# EasyEDA Pro project ProPrj_PGEKI_MAIN_2025-10-30.epro

# Schematic MinigekiPCB

## Sheets
1 main
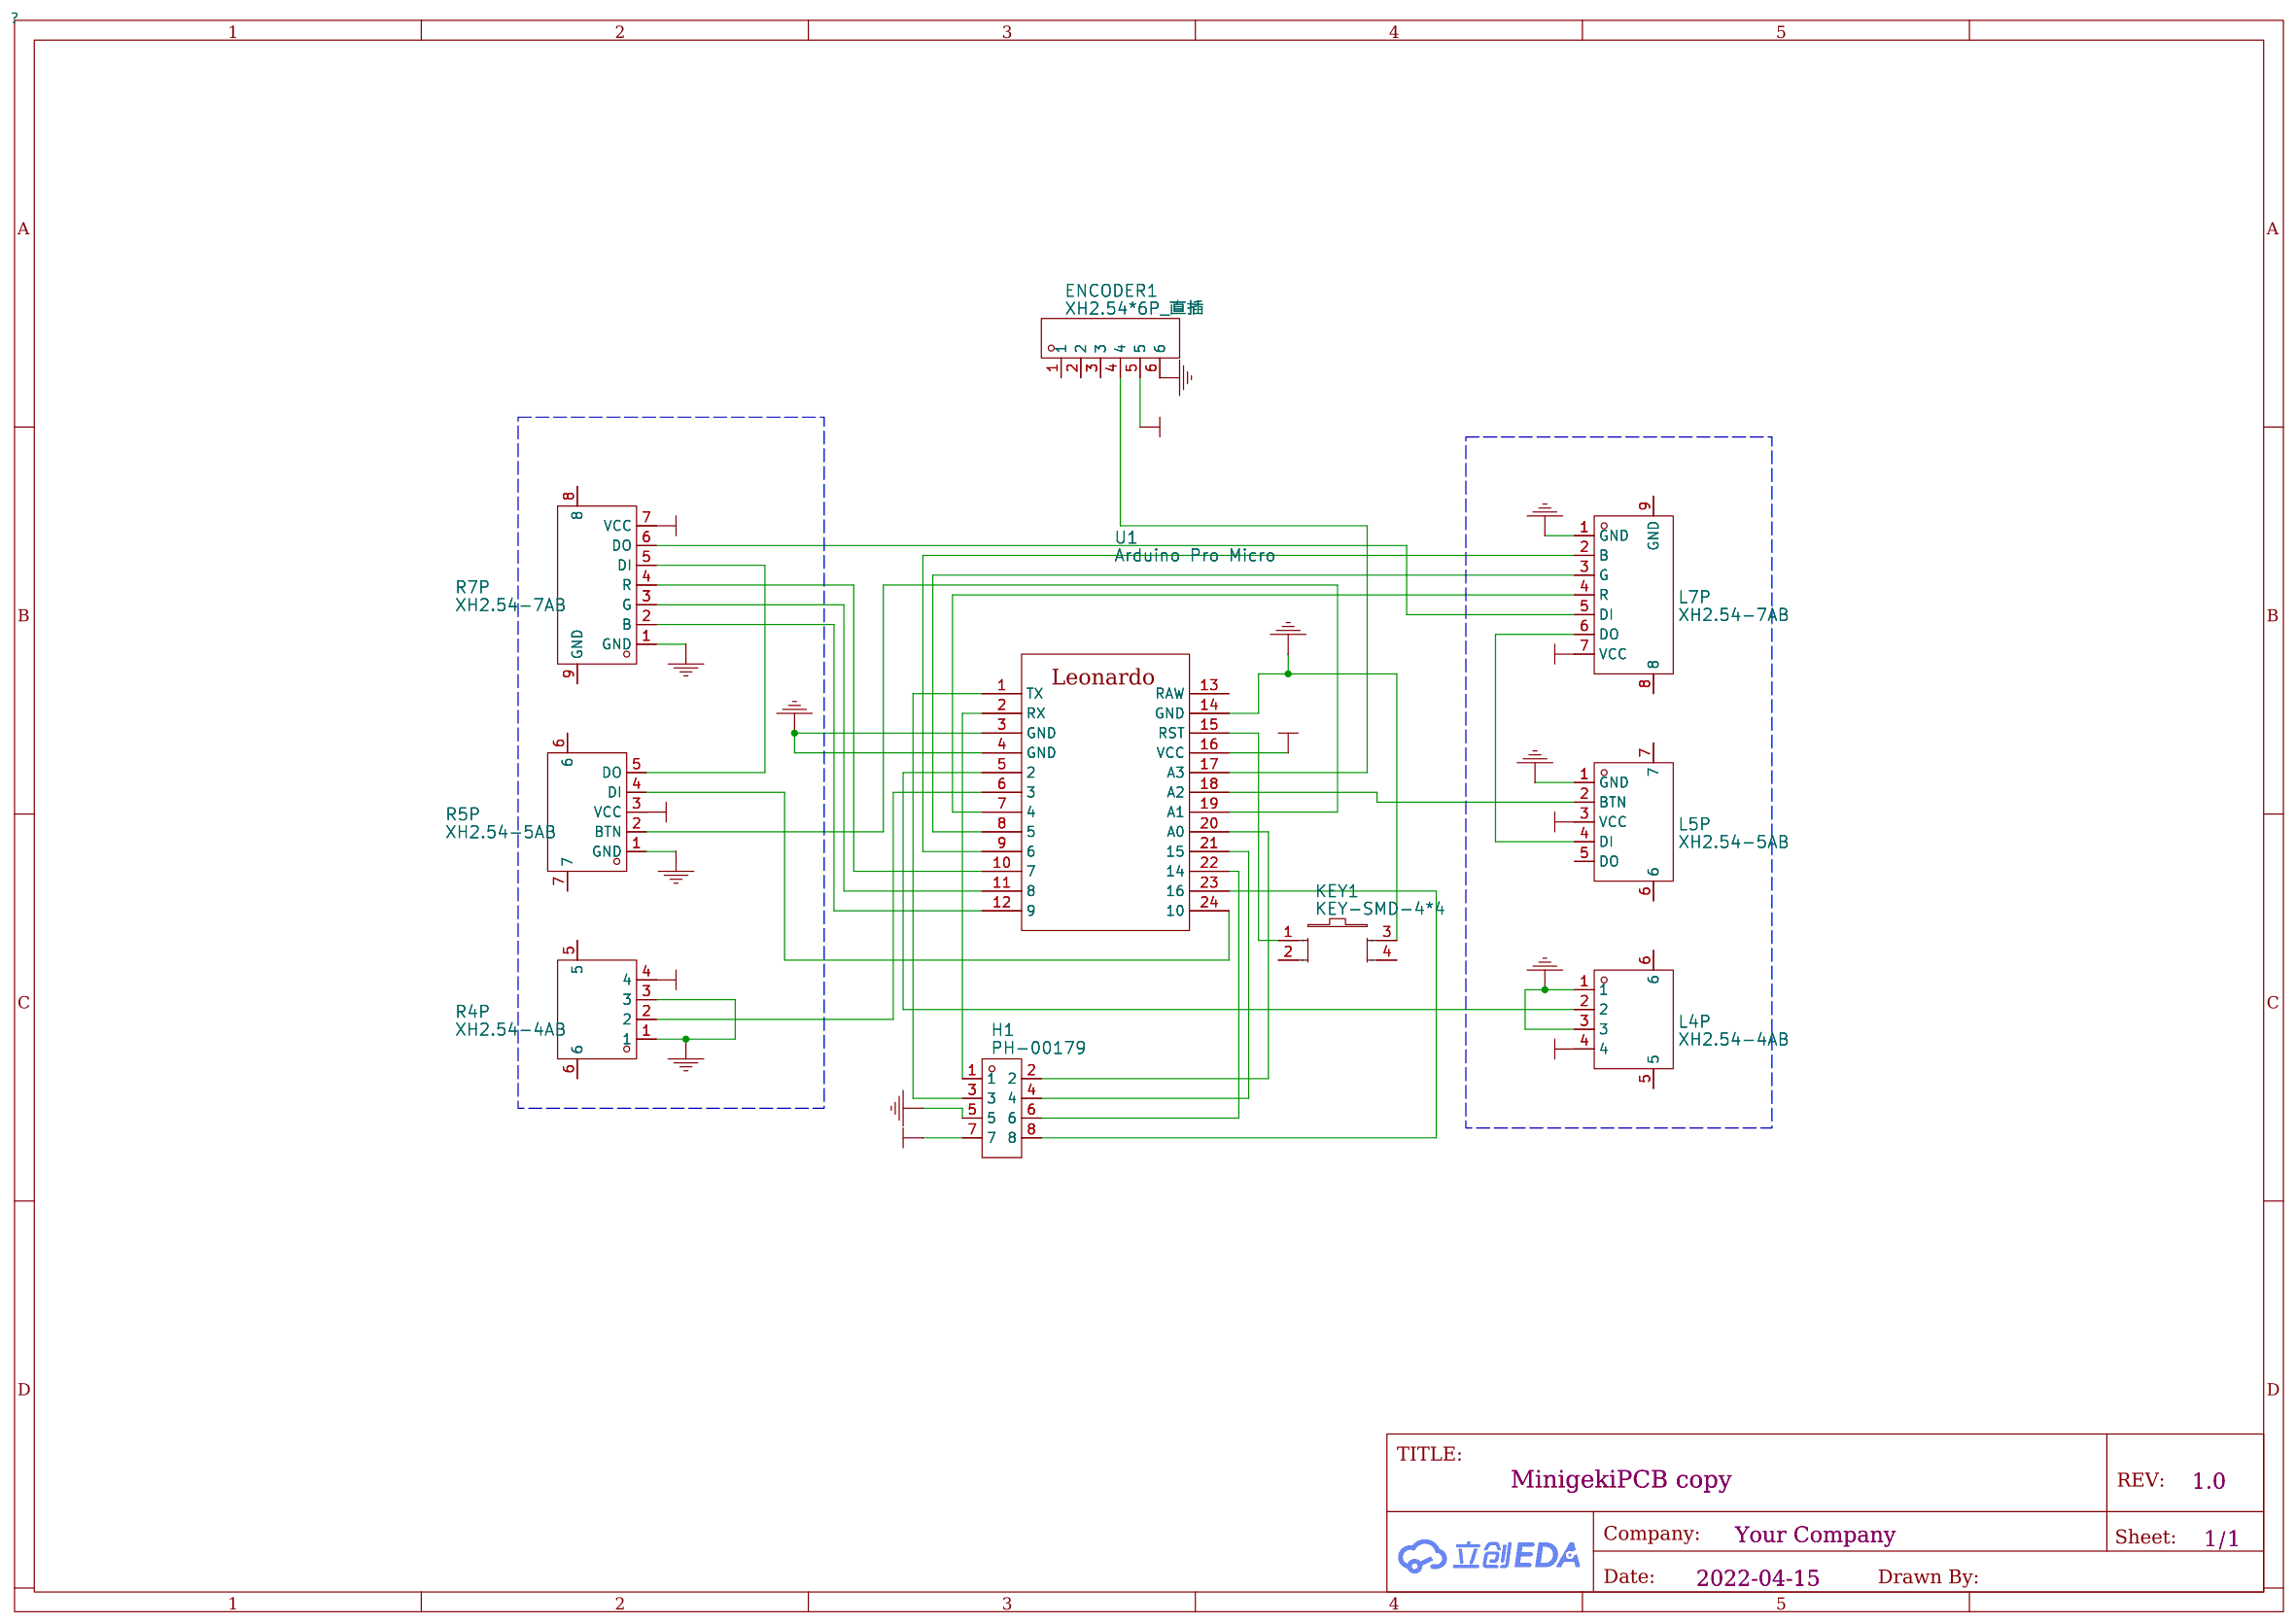
[diagram p0: main]
2 Sheet_2
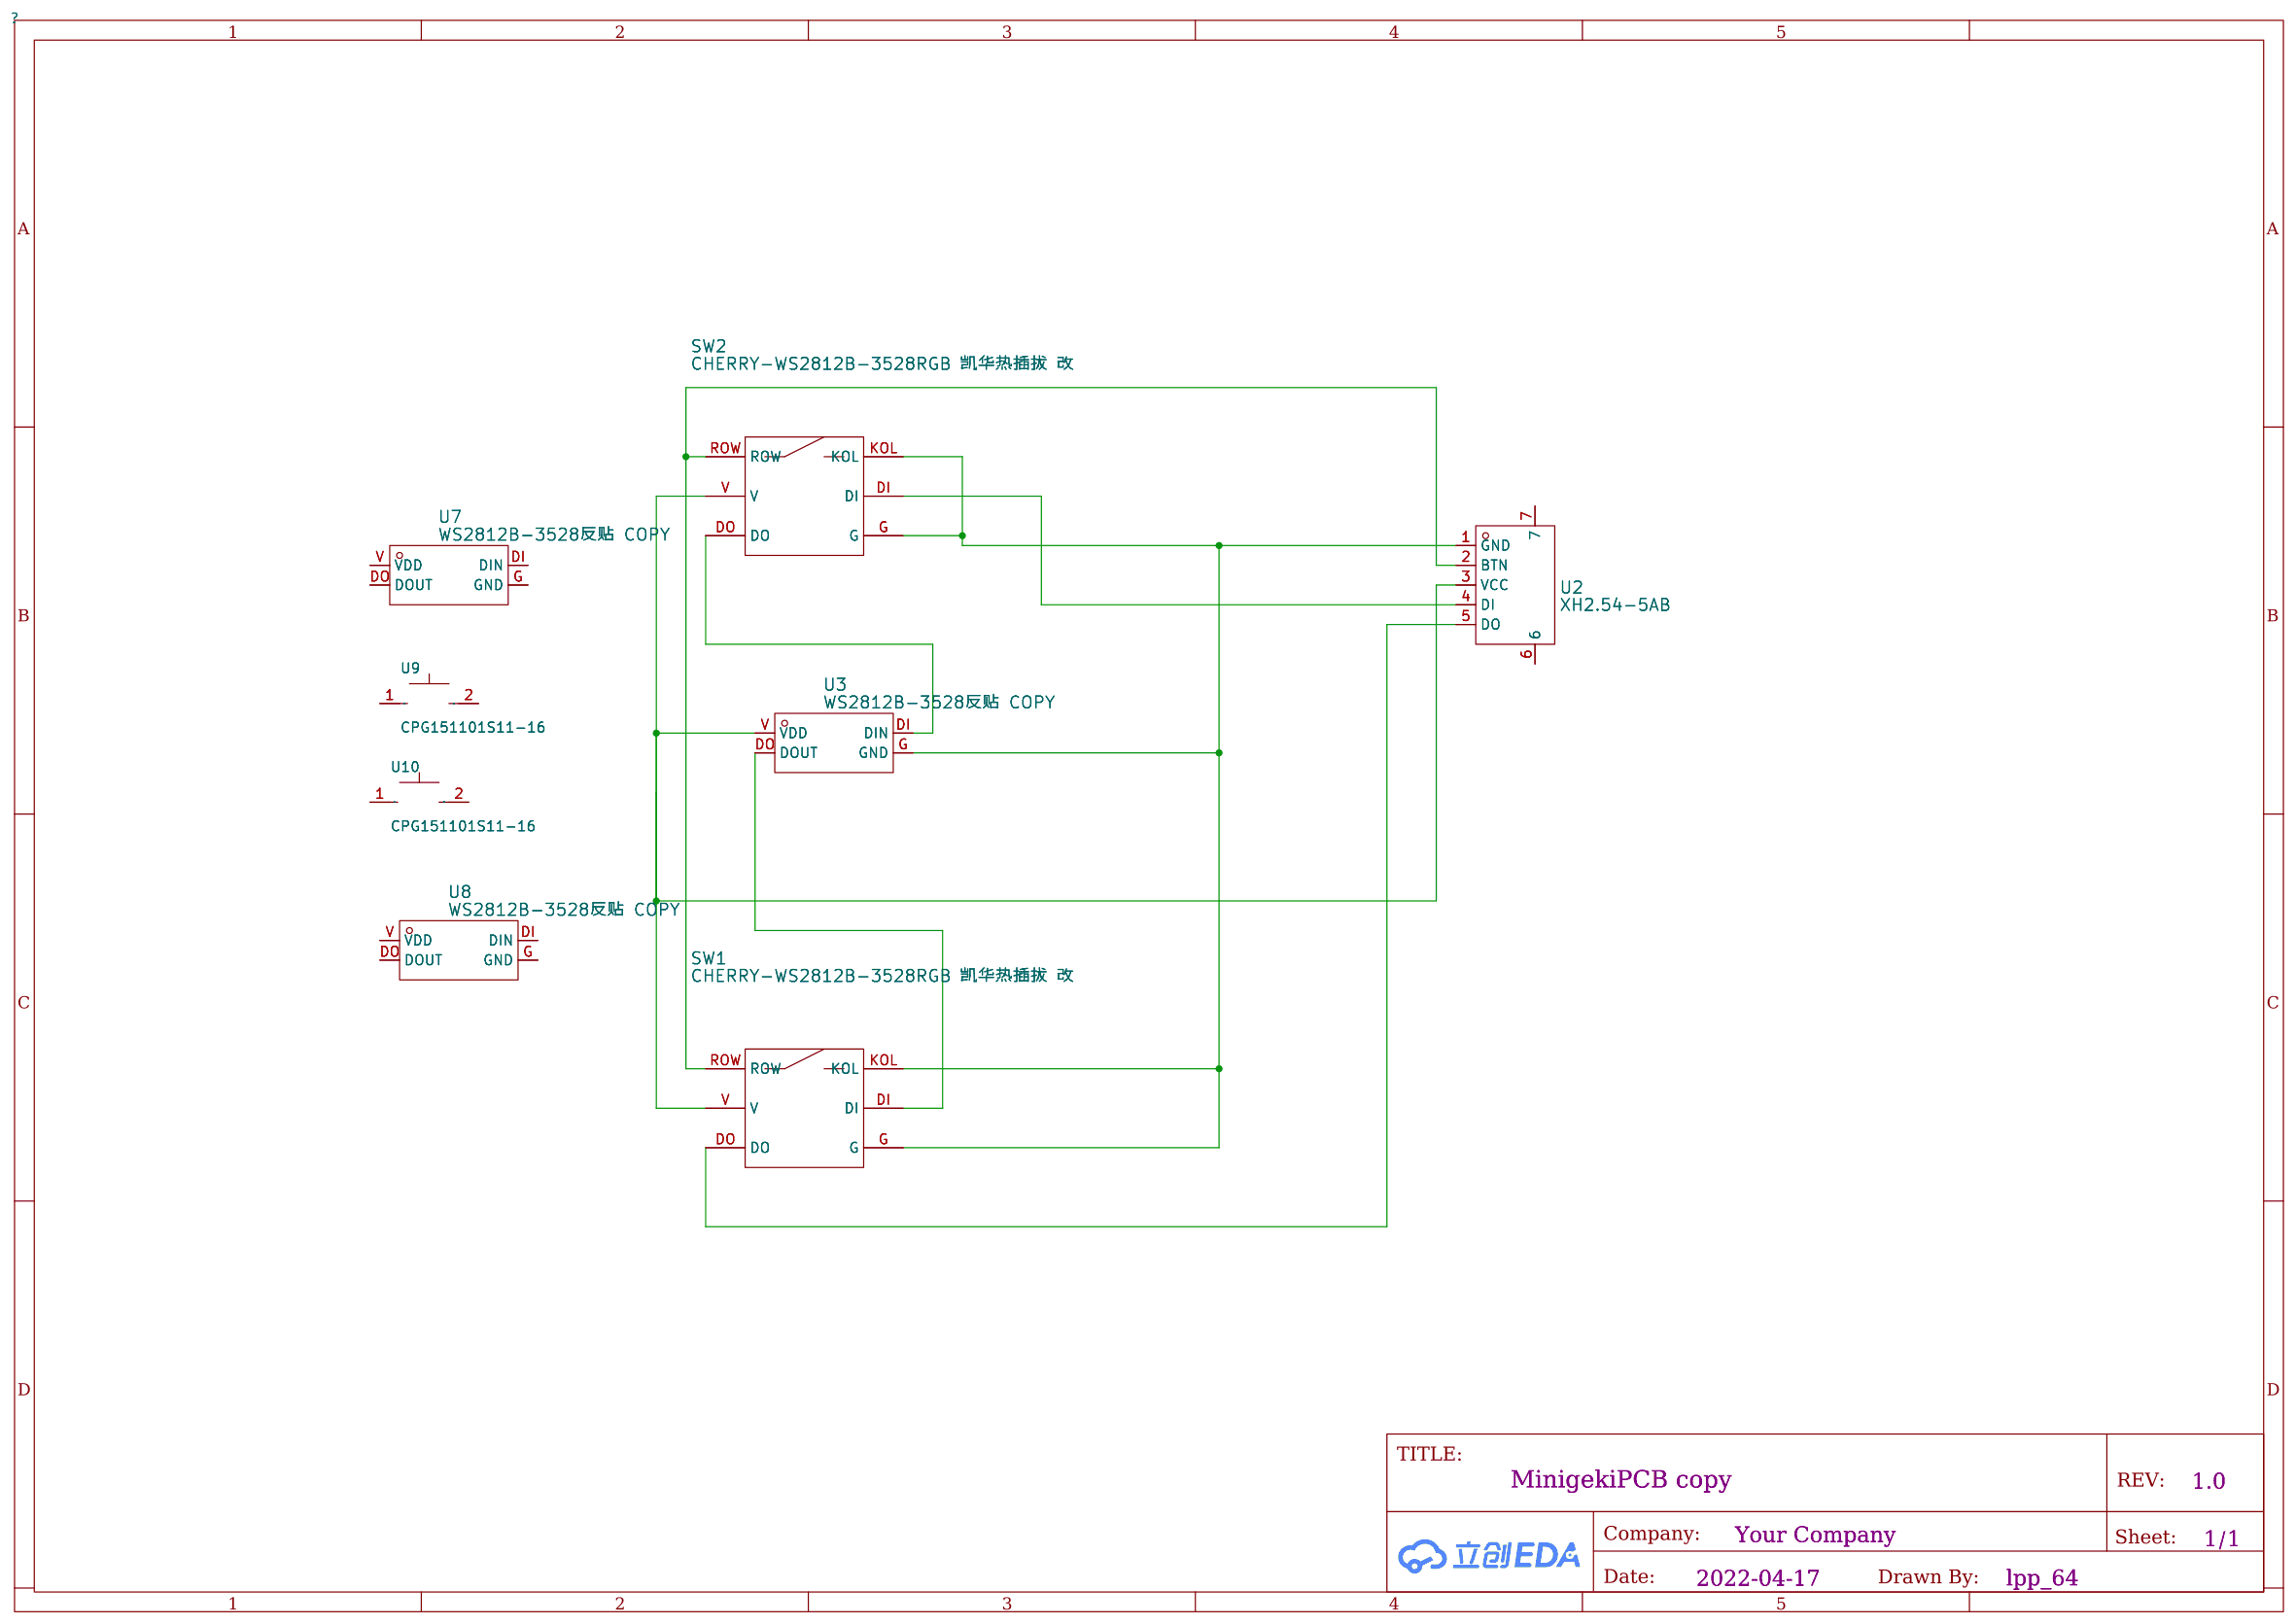
[diagram p1: Sheet_2]
3 Sheet_3
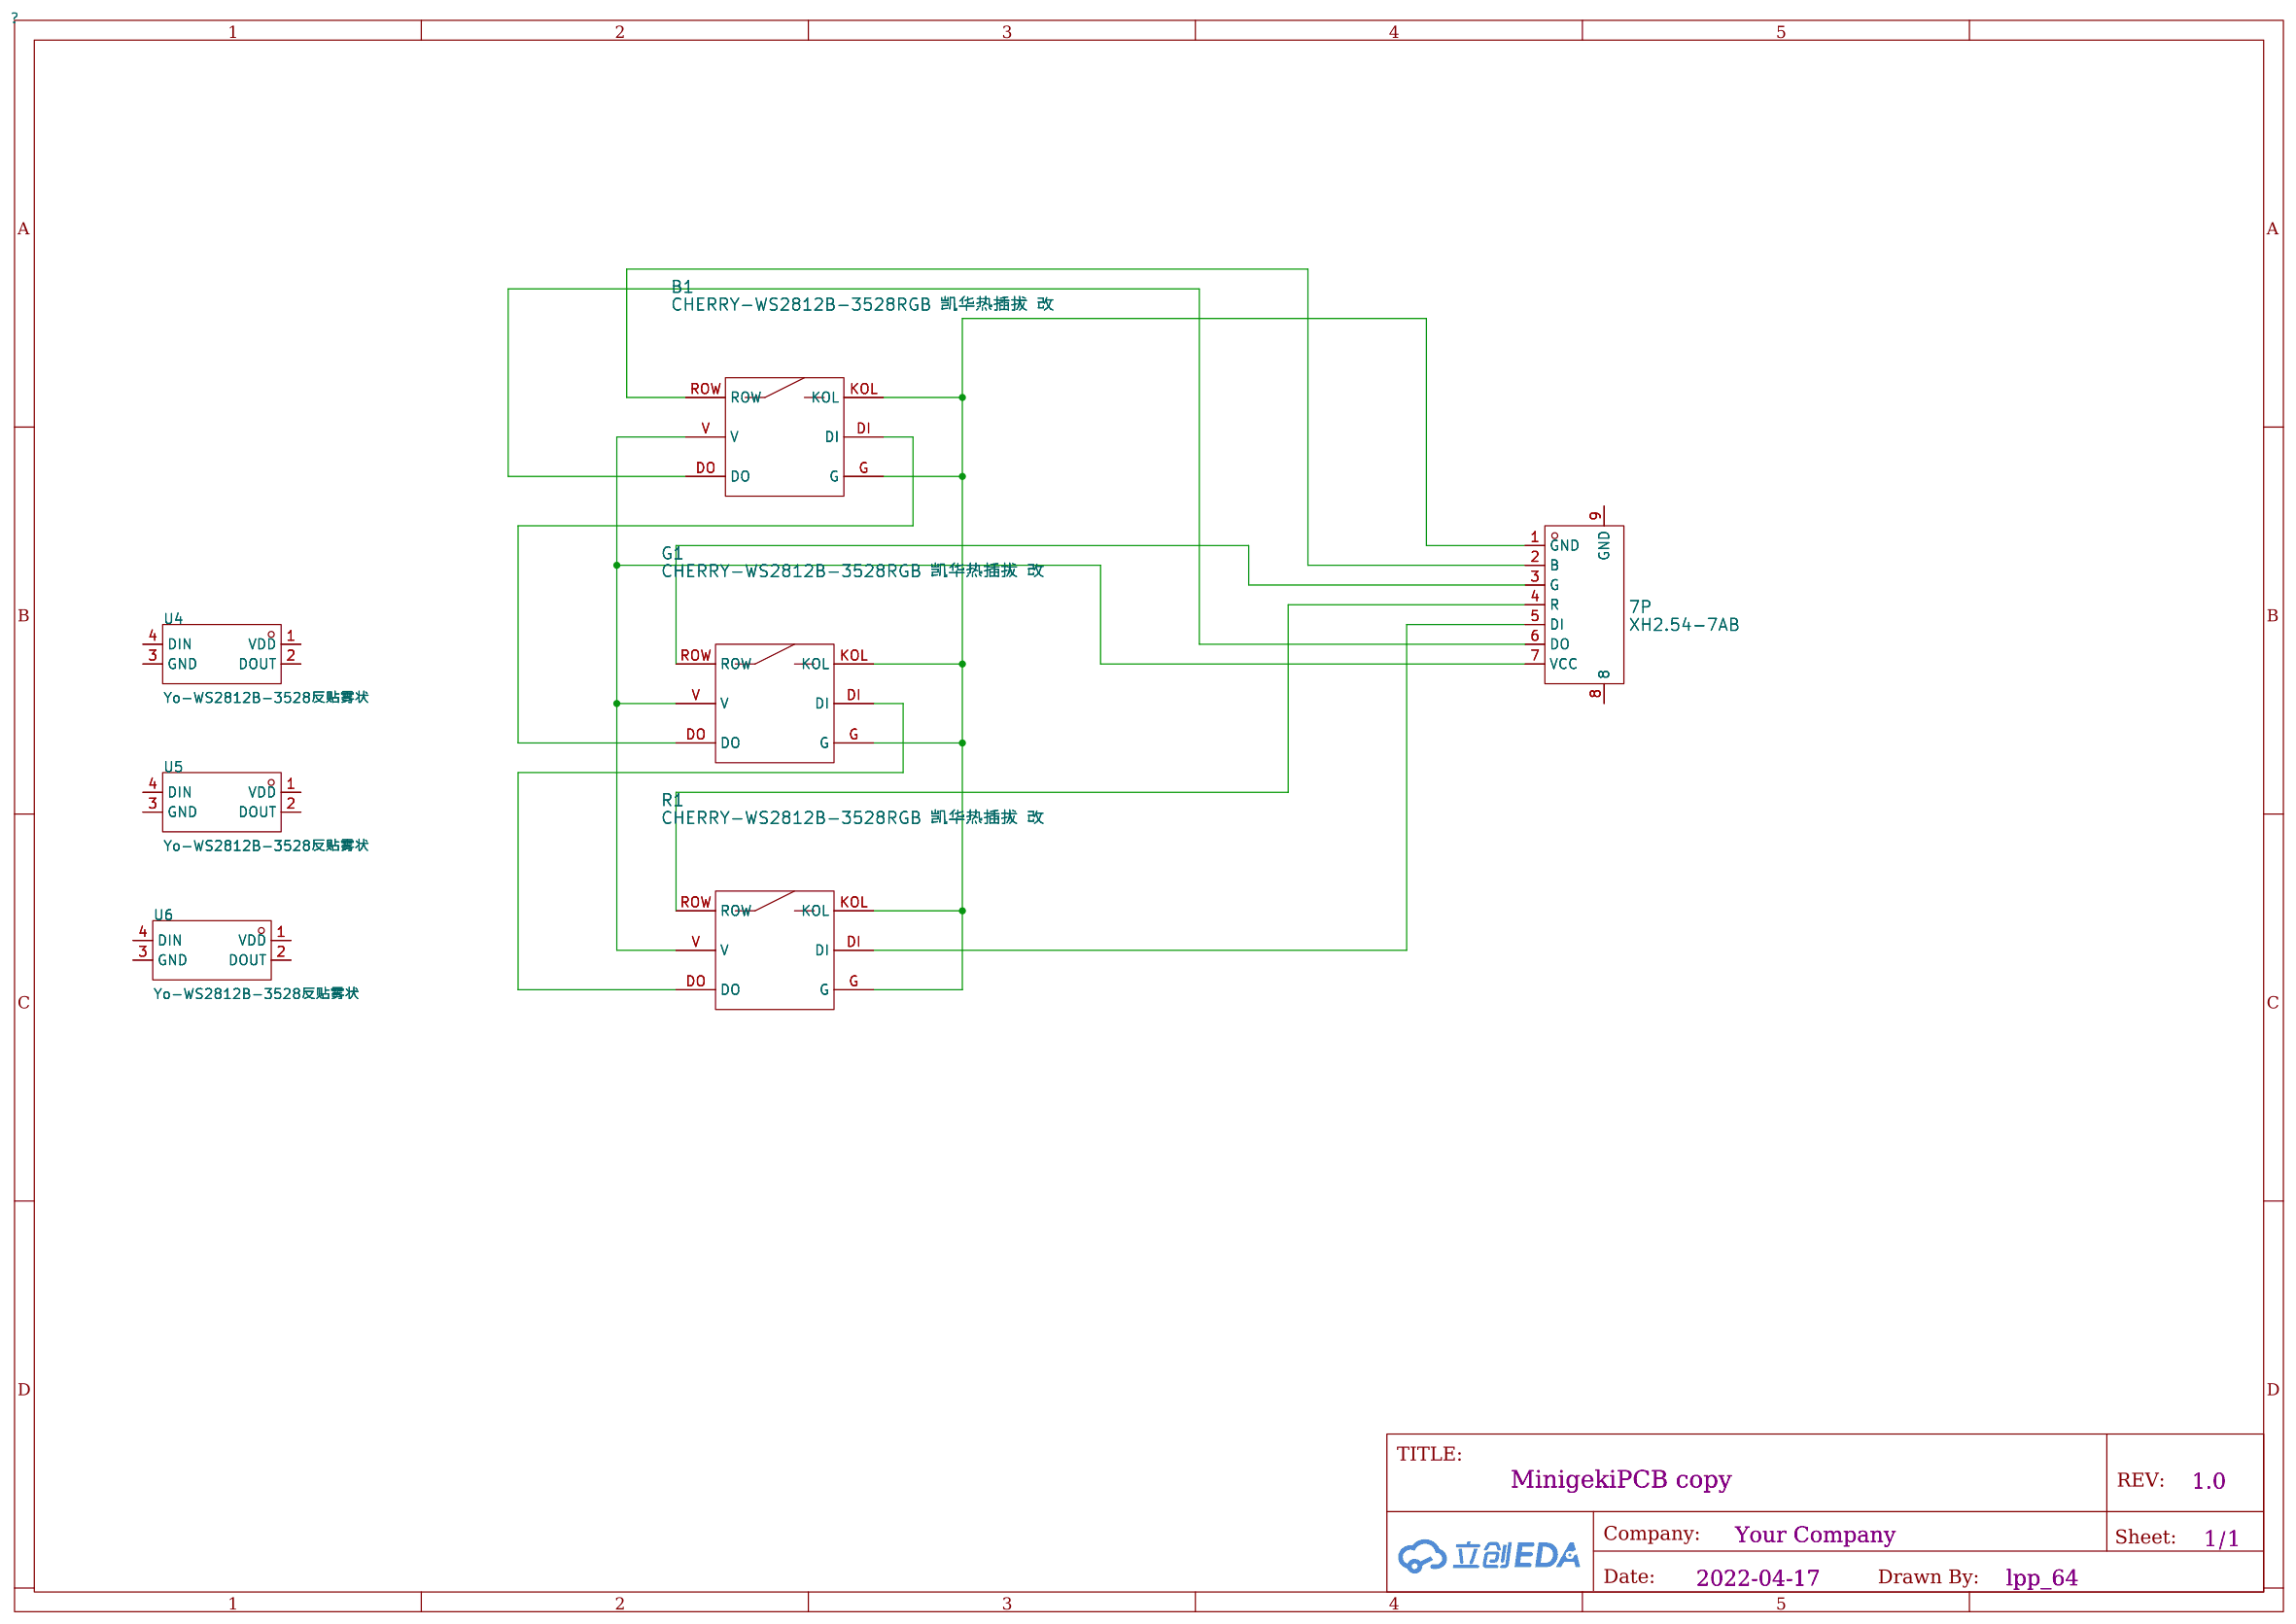
[diagram p2: Sheet_3]

## Parts
sheet main
ENCODER1  XH2.54*6P_直插  [CONN-TH_XH2.54-6P]
H1  PH-00179  [HDR-TH_8P-P2.54-V-M-R2-C4-S2.54]
KEY1  KEY-SMD-4*4  [SW-SMD_4P-L5.2-W5.2-P3.70-LS6.5]
L4P  XH2.54-4AB  [CONN-SMD_4P-P2.54_XH2.54-4AB]
L5P  XH2.54-5AB  [CONN-SMD_5P-P2.54_XH2.54-5AB]
L7P  XH2.54-7AB  [CONN-SMD_7P-P2.54_XH2.54-7AB]
R4P  XH2.54-4AB  [CONN-SMD_4P-P2.54_XH2.54-4AB]
R5P  XH2.54-5AB  [CONN-SMD_5P-P2.54_XH2.54-5AB]
R7P  XH2.54-7AB  [CONN-SMD_7P-P2.54_XH2.54-7AB]
U1  Arduino Pro Micro  [PROMICRO]
sheet Sheet_2
SW1  CHERRY-WS2812B-3528RGB 凯华热插拔 改  [凯华热插拔-WS2812-3528灯反贴-带二极管-KAILH-IN4148-3528]
SW2  CHERRY-WS2812B-3528RGB 凯华热插拔 改  [凯华热插拔-WS2812-3528灯反贴-带二极管-KAILH-IN4148-3528]
U2  XH2.54-5AB  [CONN-SMD_5P-P2.54_XH2.54-5AB]
U3  WS2812B-3528反贴 COPY  [WS2812-3528-反贴]
U7  WS2812B-3528反贴 COPY  [WS2812-3528-反贴]
U8  WS2812B-3528反贴 COPY  [WS2812-3528-反贴]
U9  CPG151101S11-16  [SMD_KEYBOARD-SW]
U10  CPG151101S11-16  [SMD_KEYBOARD-SW]
sheet Sheet_3
7P  XH2.54-7AB  [CONN-SMD_7P-P2.54_XH2.54-7AB]
B1  CHERRY-WS2812B-3528RGB 凯华热插拔 改  [凯华热插拔-WS2812-3528灯反贴-带二极管-KAILH-IN4148-3528]
G1  CHERRY-WS2812B-3528RGB 凯华热插拔 改  [凯华热插拔-WS2812-3528灯反贴-带二极管-KAILH-IN4148-3528]
R1  CHERRY-WS2812B-3528RGB 凯华热插拔 改  [凯华热插拔-WS2812-3528灯反贴-带二极管-KAILH-IN4148-3528]
U4  Yo-WS2812B-3528反贴雾状  [LED-SMD_L3.2-W2.8-BR_DY-S352818]
U5  Yo-WS2812B-3528反贴雾状  [LED-SMD_L3.2-W2.8-BR_DY-S352818]
U6  Yo-WS2812B-3528反贴雾状  [LED-SMD_L3.2-W2.8-BR_DY-S352818]

## Library data of the parts
ENCODER1 = XH2.54*6P_直插: Supplier: LCSC; Supplier Part: C9900008614; Manufacturer: null; JLCPCB Part Class: Extended Part
H1 = PH-00179: Supplier: LCSC; Supplier Part: C2829882; Manufacturer: Liansheng(连盛); JLCPCB Part Class: Extended Part
KEY1 = KEY-SMD-4*4: Supplier: LCSC; Supplier Part: C9900013835; Manufacturer: null; link: https://atta.szlcsc.comnull; JLCPCB Part Class: Extended Part
L4P R4P = -: Supplier: LCSC; Supplier Part: C146127; Manufacturer: Boom Precision Elec; JLCPCB Part Class: Extended Part
L5P R5P U2 = -: Supplier: LCSC; Supplier Part: C146128; Manufacturer: Boom Precision Elec; JLCPCB Part Class: Extended Part
L7P R7P = -: Supplier: LCSC; Supplier Part: C146130; Manufacturer: Boom Precision Elec; JLCPCB Part Class: Extended Part
U1 = Arduino Pro Micro
SW1 SW2 = CherryMX
U3 U7 U8 = Yo-WS2812B-3528反贴雾状: Supplier: LCSC; Supplier Part: C9900003682; Manufacturer: null; JLCPCB Part Class: Extended Part
U9 U10 = CPG151101S11-16: 轴类型:-;工作电压:2V~12V;操作力:-;触底力:-;触发行程:-;总行程:-;针脚数:-;机械寿命:-;工作温度:-;; Supplier Part: C5156480; Manufacturer: Kailh(凯华); JLCPCB Part Class: Extended Part; Datasheet: https://atta.szlcsc.com/upload/public/pdf/source/20220829/33DFC1A320A078D20879F2B21562B513.pdf; Supplier: LCSC; Operating Voltage: 2V~12V
7P = XH2.54-7AB: link: https://item.szlcsc.com/157457.html; 3DModel: CONN-SMD_XH2.50-LS-7P; Supplier: LCSC; Supplier Part: C146130; Manufacturer: Boom Precision Elec; JLCPCB Part Class: Extended Part
B1 G1 R1 = CHERRY-WS2812B-3528RGB 凯华热插拔 改 无二极管: Manufacturer Part: CherryMX
U4-U6 = Yo-WS2812B-3528反贴雾状: Supplier Part: C9900003682; Supplier Footprint: LED-SMD_L3.2-W2.8-BR_DY-S35281; JLCPCB Part Class: Extended Part; Datasheet: https://atta.szlcsc.comnull; Supplier: LCSC

## Nets
GND: ENCODER1.6 H1.5 KEY1.3 L4P.1 L4P.3 L5P.1(GND) L7P.1(GND) R4P.1 R4P.3 R5P.1(GND) R7P.1(GND) U1.3(GND) U1.4(GND) U1.14(GND)
VCC: ENCODER1.5 H1.7 L4P.4 L5P.3(VCC) L7P.7(VCC) R4P.4 R5P.3(VCC) R7P.7(VCC) U1.16(VCC)
$1N78: R5P.5(DO) R7P.5(DI)
$1N79: L7P.5(DI) R7P.6(DO)
$1N80: L5P.4(DI) L7P.6(DO)
$1N105: R4P.2 U1.6(3)
$1N106: L4P.2 U1.5(2)
$1N107: R5P.2(BTN) U1.19(A1)
$1N108: L5P.2(BTN) U1.18(A2)
$1N109: R7P.4(R) U1.10(7)
$1N110: R7P.3(G) U1.11(8)
$1N111: R7P.2(B) U1.12(9)
$1N112: L7P.4(R) U1.7(4)
$1N113: L7P.3(G) U1.8(5)
$1N114: L7P.2(B) U1.9(6)
$1N115: R5P.4(DI) U1.24(10)
$1N135: ENCODER1.4 U1.17(A3)
$1N232: H1.2 U1.20(A0)
$1N233: H1.4 U1.21(15)
$1N234: H1.6 U1.22(14)
$1N235: H1.8 U1.23(16)
$1N236: H1.3 U1.1(TX)
$1N237: H1.1 U1.2(RX)
Net-(7P-1): 7P.1(GND) B1.G B1.KOL G1.G G1.KOL R1.G R1.KOL
Net-(7P-2): 7P.2(B) B1.ROW
Net-(7P-3): 7P.3(G) G1.ROW
Net-(7P-4): 7P.4(R) R1.ROW
Net-(7P-5): 7P.5(DI) R1.DI
Net-(7P-6): 7P.6(DO) B1.DO
Net-(7P-7): 7P.7(VCC) B1.V G1.V R1.V
Net-(B1-DI): B1.DI G1.DO
Net-(G1-DI): G1.DI R1.DO
Net-(KEY1-1): KEY1.1 U1.15(RST)
Net-(SW1-DI): SW1.DI U3.DO(DOUT)
Net-(SW1-DO): SW1.DO U2.5(DO)
Net-(SW1-G): SW1.G SW1.KOL SW2.G SW2.KOL U2.1(GND) U3.G(GND)
Net-(SW1-ROW): SW1.ROW SW2.ROW U2.2(BTN)
Net-(SW1-V): SW1.V SW2.V U2.3(VCC) U3.V(VDD)
Net-(SW2-DI): SW2.DI U2.4(DI)
Net-(SW2-DO): SW2.DO U3.DI(DIN)

Not connected (* = marked no-connect by the designer): 7P 8 9(GND); ENCODER1 1 2 3; KEY1 2 4; L4P 5 6; L5P 5(DO) 6 7; L7P 8 9(GND); R4P 5 6; R5P 6 7; R7P 8 9(GND); U1 13(RAW); U2 6 7; U4 1(VDD) 2(DOUT) 3(GND) 4(DIN); U5 1(VDD) 2(DOUT) 3(GND) 4(DIN); U6 1(VDD) 2(DOUT) 3(GND) 4(DIN); U7 DI(DIN) DO(DOUT) G(GND) V(VDD); U8 DI(DIN) DO(DOUT) G(GND) V(VDD); U9 1 2; U10 1 2

# Board button_PCB1
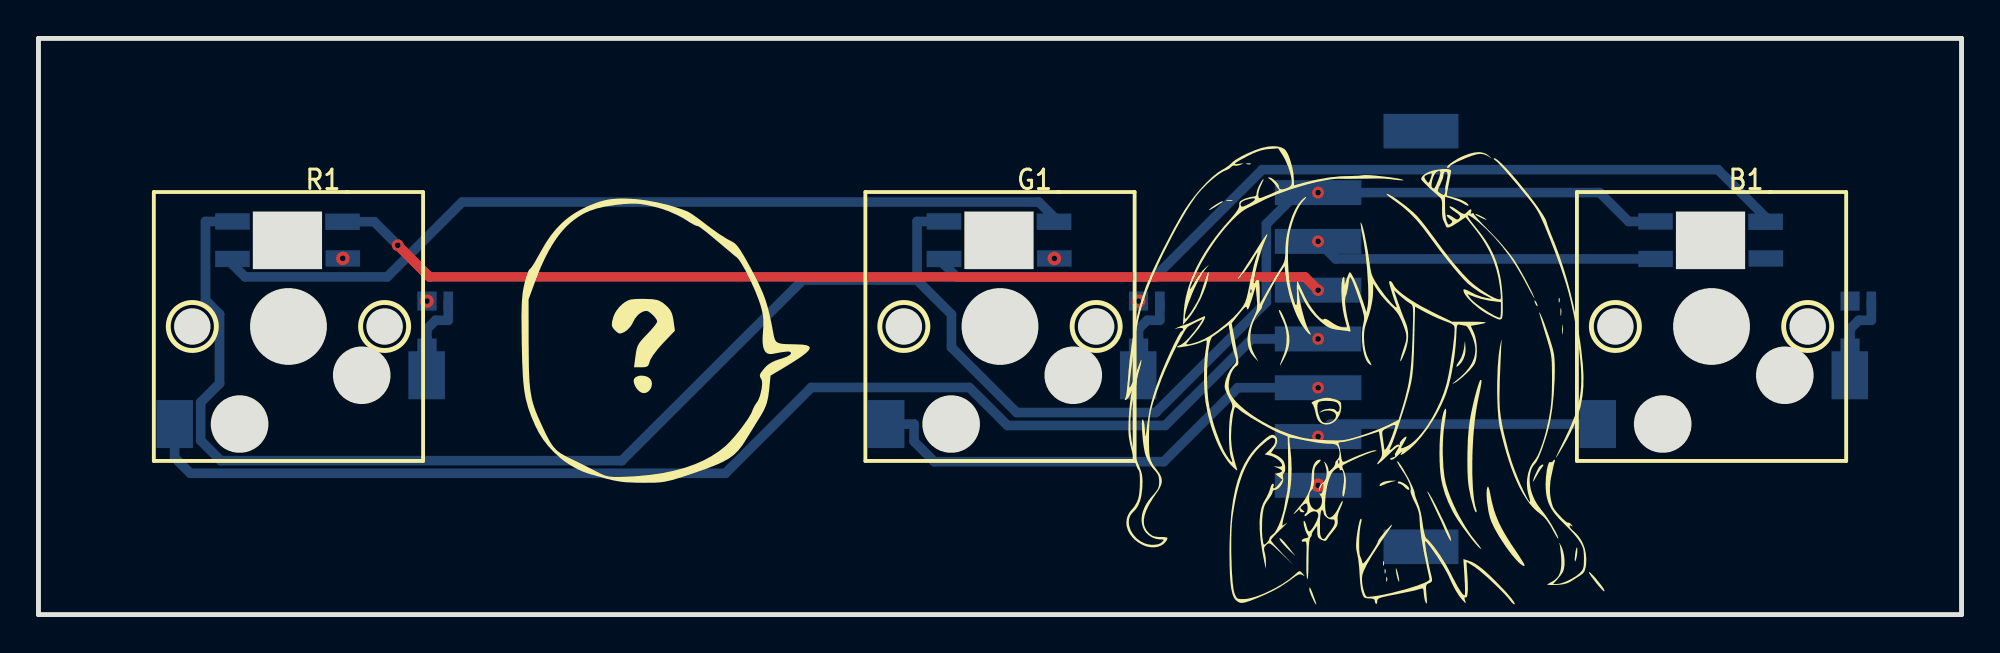
[diagram p3: board, top side]
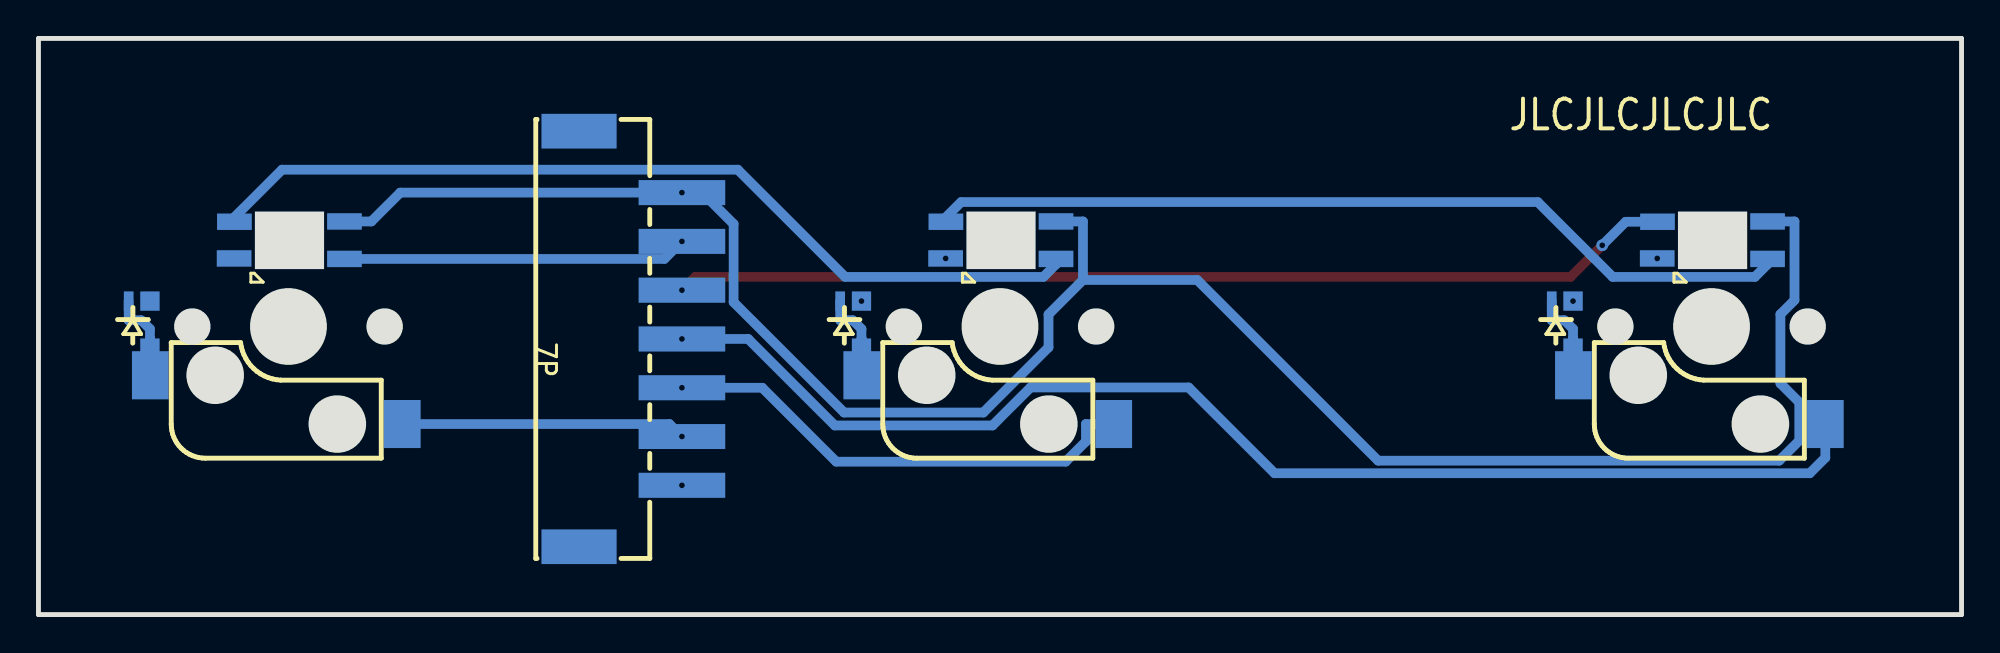
[diagram p4: board, bottom side, seen from below]

Outline 100 x 30 mm; copper layers: Top Layer, Bottom Layer. Coordinates in mm from the lower left corner of the outline.
Outline path: 0,30 100,30 100,0 0,0 0,30
Stack: Top Layer 0.035mm / Dielectric1 1.51mm FR4 er 4.5 / Bottom Layer 0.035mm

## Design rules (mm)
spacing Default (default): track to track 0.152, other pairs 0 to 0.152
track width Default (default): min 0.5, default 0.5, max 25.4
differential pair differentialPair (default): width min 0.127, default 0.254, max 2.54; gap min 0.152, default 0.152
via Default (default): diameter min 0.61, default 0.61, max 100.025; hole min 0.305, default 0.305, max 59.995
net R_G uses gge43096
pour e85 uses gge43096

## Placement (name value [footprint] x y rotation side)
7P  XH2.54-7AB  [CONN-SMD_7P-P2.54_XH2.54-7AB]  69.22 14.35 90 bottom
B1  CHERRY-WS2812B-3528RGB 凯华热插拔 改  [凯华热插拔-WS2812-3528灯反贴-带二极管-KAILH-IN4148-3528]  87 15 0 top
G1  CHERRY-WS2812B-3528RGB 凯华热插拔 改  [凯华热插拔-WS2812-3528灯反贴-带二极管-KAILH-IN4148-3528]  50 15 0 top
R1  CHERRY-WS2812B-3528RGB 凯华热插拔 改  [凯华热插拔-WS2812-3528灯反贴-带二极管-KAILH-IN4148-3528]  13 15 0 top

## Footprints (pads in the part's own frame, mm; a bottom-side part is the same pattern mirrored in y, then rotated)
CONN-SMD_7P-P2.54_XH2.54-7AB
  rect 1.3x4.5 smd: 1(-7.62,-2.675) 2(-5.08,-2.675) 3(-2.54,-2.675) 4(0,-2.675) 5(2.54,-2.675) 6(5.08,-2.675) 7(7.62,-2.675)
  rect 1.8x3.9 smd: 8(-10.82,2.675) 9(10.82,2.675)
凯华热插拔-WS2812-3528灯反贴-带二极管-KAILH-IN4148-3528
  rect 0.5x1 smd far side: 1(8.31,1.323)
  rect 1.8x0.85 smd far side: DI(2.811,5.453) DO(-2.912,3.517) G(2.826,3.543) V(-2.913,5.469)
  rect 1.9x2.5 smd far side: KOL(7.188,-2.54) ROW(-5.918,-5.08)
  rect 1x1 smd far side: R1(7.203,1.323) R2(7.203,-1.128)

## Nets
7P_2: 7P.2 B1.ROW
7P_3: 7P.3 G1.ROW
7P_6: 7P.6 B1.DO
7P_8: 7P.8
7P_9: 7P.9
B_DI: B1.DI G1.DO
B_KOL: B1.1 B1.KOL B1.R2
G_KOL: G1.1 G1.KOL G1.R2
R_DI: 7P.5 R1.DI
R_DO: G1.DI R1.DO
R_G: 7P.1 B1.G B1.R1 G1.G G1.R1 R1.G R1.R1
R_R2: R1.1 R1.KOL R1.R2
R_ROW: 7P.4 R1.ROW
R_V: 7P.7 B1.V G1.V R1.V

## Via types
v1: diameter 0.7, hole 0.305, Top Layer to Bottom Layer, 5 vias
v2: diameter 0.61, hole 0.305, Top Layer to Bottom Layer, 7 vias

## Routing (per net, layer and track width the routed paths; a pad name or vN(x,y) marks a point on that pad's centre or on a via; arc(x,y) is an arc through that point)
7P_2: length 14.8
  Bottom Layer w0.5: v2(66.54,9.27) 67.19,9.92 81.08,9.92
7P_3: length 25.4
  Bottom Layer w0.5: 44.08,9.92 45.53,9.92 45.53,9.01 46.58,7.96 58.52,7.96 62.37,11.81 v2(66.54,11.81)
7P_6: length 17.9
  Bottom Layer w0.5: v2(66.54,19.43) 67.45,18.52 B1.DO
B_DI: length 46.8
  Bottom Layer w0.5: B1.DI 89.81,20.69 87.33,23.17 63.64,23.17 58.05,17.58 47.74,17.58 47.09,18.24 G1.DO
B_KOL: length 5.2
  Bottom Layer w0.5: 94.19,12.46 94.19,14.36 94.2,14.37 ; 94.2,14.37 94.2,13.87 ; 94.2,14.37 94.2,14.87 94.65,15.32 95.31,15.32 B1.1
G_KOL: length 5.2
  Bottom Layer w0.5: 57.2,14.37 57.2,14.87 57.65,15.32 58.31,15.32 G1.1 ; 57.2,14.37 57.19,14.36 57.19,12.46 ; 57.2,14.37 57.2,13.87
R_DI: length 52.2
  Top Layer w0.5: v2(66.54,16.89) 65.85,17.58 20.33,17.58 v2(18.68,19.23)
  Bottom Layer w0.5: v2(18.68,19.23) 17.46,20.45 R1.DI
R_DO: length 45.4
  Bottom Layer w0.5: 52.81,20.45 52.81,20.69 52.02,21.48 22.03,21.48 18.14,17.58 10.74,17.58 10.09,18.24 R1.DO
R_G:
  vias: v1(15.83,18.54) v1(20.2,16.32) v1(52.83,18.54) v1(57.2,16.32) v1(66.54,6.73)
R_R2: length 5.2
  Bottom Layer w0.5: 20.2,13.87 20.2,14.37 ; 20.2,14.37 20.19,14.36 20.19,12.46 ; 20.2,14.37 20.2,14.87 20.65,15.32 21.31,15.32 R1.1
R_ROW: length 66.1
  Bottom Layer w0.5: 7.08,9.92 7.08,8.17 7.89,7.36 35.72,7.36 40.19,11.83 48.41,11.83 50.39,9.85 58.59,9.85 63.09,14.35 v2(66.54,14.35)
R_V: length 109.6
  Bottom Layer w0.5: 45.69,17.42 47.48,15.63 47.48,13.91 50.87,10.52 58.1,10.52 63.85,16.27 63.85,20.34 65.49,21.97 v2(66.54,21.97) 81.19,21.97 82.69,20.47 B1.V ; 45.69,17.42 39.74,17.42 30.34,8.02 9.48,8.02 8.44,9.06 8.44,11.05 9.42,12.03 9.42,15.64 8.69,16.37 8.69,20.47 R1.V ; 45.69,17.42 45.69,20.47 G1.V

## Copper pours and planes (outline as drawn; the poured copper is in the pictures)
R_G on Top Layer: -10.67,43.81 -10.67,-6.35 1.4,-18.41 112.52,-18.41 117.73,-13.21 117.73,43.31 117.47,43.56
R_G on Bottom Layer: -6.86,37.72 -6.86,-10.03 -7.11,-10.29 109.35,-10.29 111.25,-8.38 111.25,32.51 108.84,34.92

## Text on the board
Bottom Silkscreen Layer: JLCJLCJLCJLC

# Board PCB_MinigekiPCB
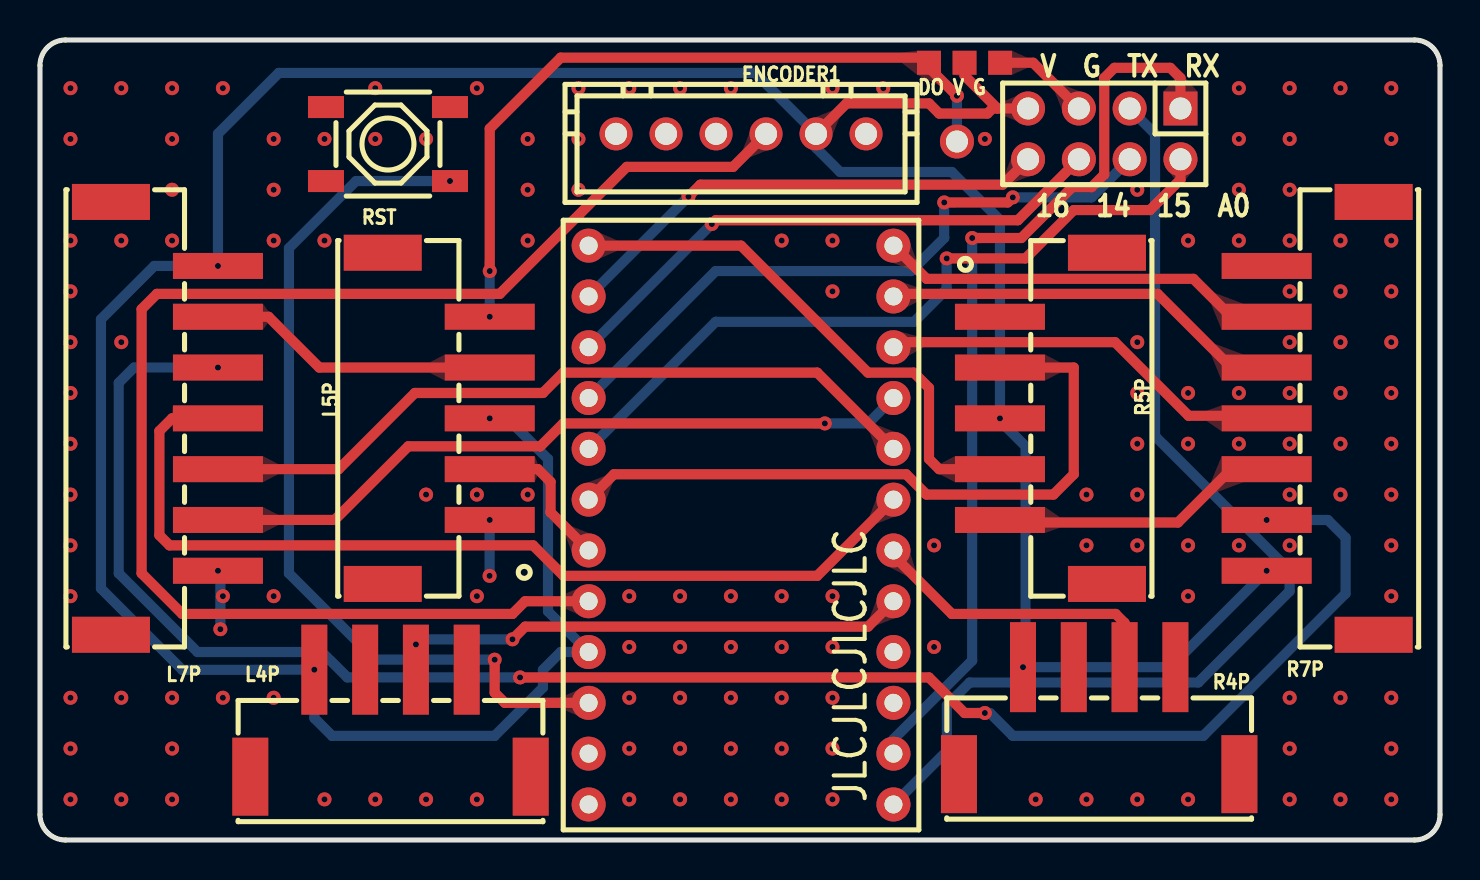
[diagram p5: board, top side]
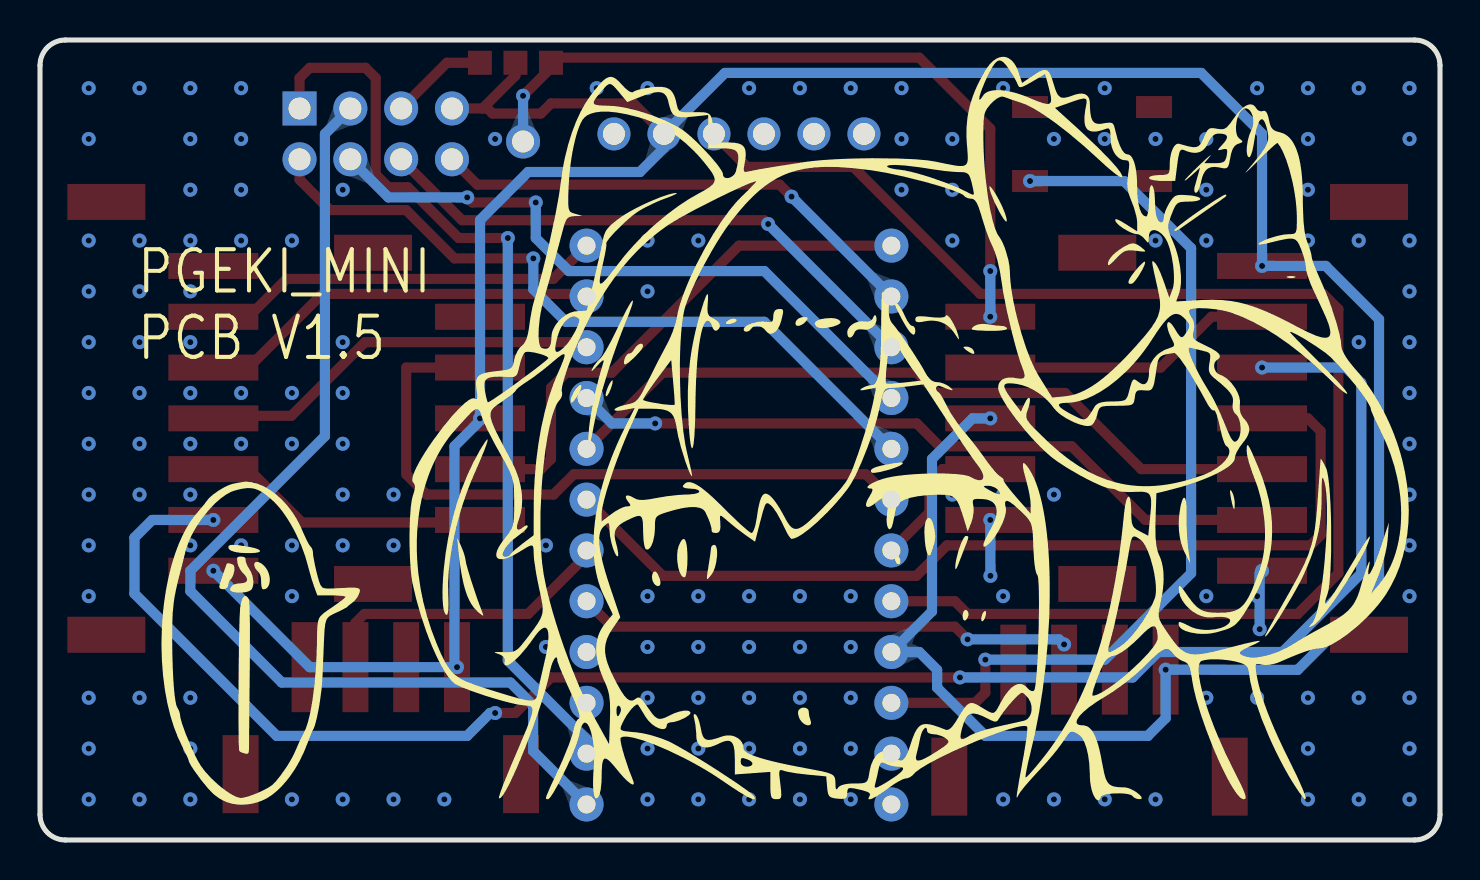
[diagram p6: board, bottom side, seen from below]

Outline 70 x 40 mm; copper layers: Top Layer, Bottom Layer. Coordinates in mm from the lower left corner of the outline.
Outline path: 0,38.73 arc(0.37,39.63) 1.27,40 68.73,40 arc(69.63,39.63) 70,38.73 70,1.27 arc(69.63,0.37) 68.73,0 1.27,0 arc(0.37,0.37) 0,1.27 0,38.73
Stack: Top Layer 0.035mm / Dielectric1 1.51mm FR4 er 4.5 / Bottom Layer 0.035mm

## Design rules (mm)
template: 用户自定义配置
spacing Default (default): track to track 0.152, other pairs 0 to 0.152
track width Default (default): min 0.254, default 0.254, max 25.4
differential pair differentialPair (default): width min 0.127, default 0.254, max 2.54; gap min 0.152, default 0.152
via Default (default): diameter min 0.7, default 0.7, max 100.025; hole min 0.305, default 0.305, max 59.995

## Placement (name value [footprint] x y rotation side)
ENCODER1  XH2.54*6P_直插  [CONN-TH_XH2.54-6P]  35.05 35.31 0 top
H1  PH-00179  [HDR-TH_8P-P2.54-V-M-R2-C4-S2.54]  53.21 35.31 180 top
L4P  XH2.54-4AB  [CONN-SMD_4P-P2.54_XH2.54-4AB]  17.53 5.84 180 top
L5P  XH2.54-5AB  [CONN-SMD_5P-P2.54_XH2.54-5AB]  19.81 21.08 90 top
L7P  XH2.54-7AB  [CONN-SMD_7P-P2.54_XH2.54-7AB]  6.22 21.08 90 top
NOREF  -  [Pad_e124]  48.01 38.86 0 top
NOREF#2  -  [Pad_e345]  45.85 34.92 180 top
NOREF#3  -  [Pad_e123]  46.23 38.86 0 top
NOREF#4  -  [Pad_e122]  44.45 38.86 0 top
R4P  XH2.54-4AB  [CONN-SMD_4P-P2.54_XH2.54-4AB]  52.96 5.97 180 top
R5P  XH2.54-5AB  [CONN-SMD_5P-P2.54_XH2.54-5AB]  50.67 21.08 270 top
R7P  XH2.54-7AB  [CONN-SMD_7P-P2.54_XH2.54-7AB]  64.01 21.08 270 top
RST  KEY-SMD-4*4  [SW-SMD_4P-L5.2-W5.2-P3.70-LS6.5]  17.4 34.8 180 top
U1  Arduino Pro Micro  [PROMICRO]  43.94 30.99 180 top

## Footprints (pads in the part's own frame, mm; a bottom-side part is the same pattern mirrored in y, then rotated)
CONN-SMD_4P-P2.54_XH2.54-4AB
  rect 1.3x4.5 smd: 1(-3.811,-2.675) 2(-1.271,-2.675) 3(1.269,-2.675) 4(3.809,-2.675)
  rect 1.8x3.9 smd: 5(-7.011,2.675) 6(7.011,2.675)
CONN-SMD_5P-P2.54_XH2.54-5AB
  rect 1.3x4.5 smd: 1(-5.08,-2.675) 2(-2.539,-2.675) 3(0.001,-2.675) 4(2.541,-2.675) 5(5.08,-2.675)
  rect 1.8x3.9 smd: 6(-8.28,2.675) 7(8.28,2.675)
CONN-SMD_7P-P2.54_XH2.54-7AB
  rect 1.3x4.5 smd: 1(-7.62,-2.675) 2(-5.08,-2.675) 3(-2.54,-2.675) 4(0,-2.675) 5(2.54,-2.675) 6(5.08,-2.675) 7(7.62,-2.675)
  rect 1.8x3.9 smd: 8(-10.82,2.675) 9(10.82,2.675)
CONN-TH_XH2.54-6P
  round 1.65 hole 1.1: 1(-6.25,0) 2(-3.75,0) 3(-1.25,0) 4(1.25,0) 5(3.75,0) 6(6.25,0)
HDR-TH_8P-P2.54-V-M-R2-C4-S2.54
  rect 1.7x1.7 hole 1.1: 1(-3.81,-1.27)
  round 1.7 hole 1.1: 2(-3.81,1.27) 3(-1.27,-1.27) 4(-1.27,1.27) 5(1.27,-1.27) 6(1.27,1.27) 7(3.81,-1.27) 8(3.81,1.27)
Pad_e122
  rect 1.2x1.2 smd: (0,0)
Pad_e123
  rect 1.2x1.2 smd: (0,0)
Pad_e124
  rect 1.2x1.2 smd: (0,0)
Pad_e345
  round 1.7 hole 1.1: 7(0,0)
PROMICRO
  round 1.7 hole 0.9: 1(1.27,29.21) 2(1.27,26.67) 3(1.27,24.13) 4(1.27,21.59) 5(1.27,19.05) 6(1.27,16.51) 7(1.27,13.97) 8(1.27,11.43) 9(1.27,8.89) 10(1.27,6.35) 11(1.27,3.81) 12(1.27,1.27) 13(16.51,29.21) 14(16.51,26.67) 15(16.51,24.13) 16(16.51,21.59) 17(16.51,19.05) 18(16.51,16.51) 19(16.51,13.97) 20(16.51,11.43) 21(16.51,8.89) 22(16.51,6.35) 23(16.51,3.81) 24(16.51,1.27)
SW-SMD_4P-L5.2-W5.2-P3.70-LS6.5
  rect 1.8x1.1 smd: 1(-3.1,1.85) 2(3.1,1.85) 3(-3.1,-1.85) 4(3.1,-1.85)

## Nets
As in the schematic, except:
GND: ENCODER1.6 H1.5 L4P.1 L4P.3 L5P.1 L7P.1 NOREF. R4P.1 R4P.3 R5P.1 R7P.1 RST.3 U1.3 U1.4 U1.14
VCC: ENCODER1.5 H1.7 L4P.4 L5P.3 L7P.7 NOREF#3. R4P.4 R5P.3 R7P.7 U1.16
$1N149: RST.1 U1.15

Pads without a net: ENCODER1 1 2 3; L4P 5 6; L5P 5 6 7; L7P 8 9; NOREF#2 7; R4P 5 6; R5P 6 7; R7P 8 9; RST 2 4; U1 13

## Via types
v1: diameter 0.7, hole 0.305, Top Layer to Bottom Layer, 28 vias
v2: diameter 0.701, hole 0.305, Top Layer to Bottom Layer, 148 vias

## Routing (per net, layer and track width the routed paths; a pad name or vN(x,y) marks a point on that pad's centre or on a via; arc(x,y) is an arc through that point)
GND: length 10.7
  Top Layer w0.508: 51.94,36.58 49.66,38.86 48.01,38.86
  Bottom Layer w0.508: v1(22.49,16) v1(22.48,13.21) ; v1(8.9,13.46) 9.02,13.34 v1(9.02,10.54)
  vias: v2(1.52,37.59) v2(1.52,35.05) v2(1.52,29.97) v2(1.52,27.43) v2(1.52,24.89) v2(1.52,22.35) v2(1.52,19.81) v2(1.52,17.27) v2(1.52,14.73) v2(1.52,12.19) v2(1.52,7.11) v2(1.52,4.57) v2(1.52,2.03) v2(4.06,37.59) v2(4.06,29.97) v2(4.06,24.89) v2(4.06,7.11) v2(4.06,2.03) v2(6.6,37.59) v2(6.6,35.05) v2(6.6,32.51) v2(6.6,29.97) v2(6.6,7.11) v2(6.6,4.57) v2(6.6,2.03) v2(9.14,37.59) v2(9.14,12.19) v2(9.14,7.11) v2(11.68,35.05) v2(11.68,32.51) v2(11.68,29.97) v2(11.68,12.19) v2(11.68,7.11) v2(14.22,35.05) v2(14.22,29.97) v2(14.22,2.03) v2(16.76,37.59) v2(16.76,35.05) v2(16.76,2.03) v2(19.3,35.05) v2(19.3,17.27) v2(19.3,2.03) v2(21.84,37.59) v2(21.84,17.27) v2(21.84,12.19) v2(21.84,2.03) v2(24.38,35.05) v2(24.38,32.51) v2(24.38,29.97) v2(24.38,17.27) v2(26.92,37.59) v2(26.92,35.05) v2(26.92,32.51) v2(29.46,37.59) v2(29.46,12.19) v2(29.46,9.65) v2(29.46,7.11) v2(29.46,4.57) v2(29.46,2.03) v2(32,37.59) v2(32,12.19) v2(32,9.65) v2(32,7.11) v2(32,4.57) v2(32,2.03) v2(34.54,37.59) v2(34.54,12.19) v2(34.54,9.65) v2(34.54,7.11) v2(34.54,4.57) v2(34.54,2.03) v2(37.08,29.97) v2(37.08,12.19) v2(37.08,9.65) v2(37.08,7.11) v2(37.08,4.57) v2(37.08,2.03) v2(39.62,37.59) v2(39.62,29.97) v2(39.62,27.43) v2(39.62,12.19) v2(39.62,9.65) v2(39.62,7.11) v2(39.62,4.57) v2(39.62,2.03) v2(42.16,37.59) v2(44.7,14.73) v2(44.7,9.65) v2(47.24,35.05) v2(49.78,2.03) v2(52.32,17.27) v2(52.32,14.73) v2(52.32,2.03) v2(54.86,32.51) v2(54.86,24.89) v2(54.86,22.35) v2(54.86,19.81) v2(54.86,17.27) v2(54.86,14.73) v2(54.86,2.03) v2(57.4,29.97) v2(57.4,22.35) v2(57.4,19.81) v2(57.4,14.73) v2(57.4,12.19) v2(57.4,2.03) v2(59.94,37.59) v2(59.94,35.05) v2(59.94,32.51) v2(59.94,29.97) v2(59.94,22.35) v2(59.94,19.81) v2(59.94,14.73) v2(62.48,37.59) v2(62.48,35.05) v2(62.48,32.51) v2(62.48,29.97) v2(62.48,27.43) v2(62.48,24.89) v2(62.48,22.35) v2(62.48,19.81) v2(62.48,17.27) v2(62.48,14.73) v2(62.48,7.11) v2(62.48,4.57) v2(62.48,2.03) v2(65.02,37.59) v2(65.02,29.97) v2(65.02,27.43) v2(65.02,24.89) v2(65.02,22.35) v2(65.02,19.81) v2(65.02,17.27) v2(65.02,7.11) v2(65.02,2.03) v2(67.56,37.59) v2(67.56,35.05) v2(67.56,29.97) v2(67.56,27.43) v2(67.56,24.89) v2(67.56,22.35) v2(67.56,19.81) v2(67.56,17.27) v2(67.56,14.73) v2(67.56,12.19) v2(67.56,7.11) v2(67.56,4.57) v2(67.56,2.03)
VCC: length 167.8
  Top Layer w0.508: 46.23,38.86 46.23,38.22 47.87,36.58 ; ENCODER1.5 40.33,36.83 44.45,36.83 44.96,36.32 47.37,36.32 47.62,36.58 47.87,36.58 ; 47.87,36.58 H1.7
  Bottom Layer w0.508: v1(22.49,21.08) 23.37,21.08 25.4,19.05 25.4,11.43 U1.16 26.03,9.4 25.15,8.51 25.15,7.62 22.73,5.21 14.61,5.21 13.72,6.09 v1(13.72,8.52) 7.11,8.51 3.05,12.57 3.05,26.03 5.72,28.7 8.9,28.7 8.9,35.31 11.94,38.35 35.75,38.35 38.8,35.31 ; v1(61.33,13.46) 56.51,8.64 v1(49.15,8.64) 49.28,8.77 49.28,19.69 48,20.96 48,31 45.59,33.4 40,33.4 38.8,34.6 38.8,35.31
  vias: v1(8.9,28.7) v1(48,21.08)
(no net): length 37.5
  Top Layer w0.508: v1(45.85,37.21) 44.45,38.61 44.45,38.86 44.2,39.12 26.03,39.12 22.49,35.57 v1(22.49,28.45)
  Bottom Layer w0.508: v1(22.49,26.16) v1(22.49,28.45) ; v1(45.85,37.21) NOREF#2.7
$1N78: length 14.5
  Top Layer w0.508: R5P.5 48.12,15.88 56.9,15.88 59.57,18.54 R7P.5
$1N79: length 89.6
  Top Layer w0.508: v1(24,8.13) 44.45,8.13 46.23,6.35 v1(47.24,6.35)
  Bottom Layer w0.508: v1(8.9,23.62) 4.7,23.62 3.94,22.86 3.94,13.33 7.87,9.4 14.1,9.4 15.37,8.13 v1(24,8.13) ; v1(47.24,6.35) 47.5,6.35 48.64,5.21 58.17,5.21 65.28,12.32 65.28,15.11 64.39,16 v1(61.33,16)
$1N80: length 14.6
  Top Layer w0.508: L5P.4 13.97,23.62 11.43,26.16 L7P.6
$1N105: length 15.4
  Top Layer w0.508: U1.6 42.67,14.22 45.59,11.3 53.78,11.3 54.23,10.85 R4P.2
$1N106: length 24.8
  Top Layer w0.508: U1.5 41.4,10.67 24.26,10.67 v1(23.62,10.03)
  Bottom Layer w0.508: v1(23.62,10.03) 19.05,10.03 v1(18.8,9.78)
$1N107: length 34.6
  Top Layer w0.508: U1.19 28.7,18.29 43.31,18.29 44.32,17.27 50.67,17.27 51.69,18.29 51.69,23.62 R5P.2
$1N108: length 7.5
  Top Layer w0.508: 22.49,18.54 24.89,18.54 25.53,17.91 25.53,16.38 U1.18
$1N109: length 20.3
  Top Layer w0.508: R7P.4 61.21,21.21 57.43,21.21 53.75,24.89 42.93,24.89 U1.10
$1N110: length 20.2
  Top Layer w0.508: R7P.3 59.57,23.62 55.88,27.31 42.8,27.31 U1.11
$1N111: length 20.1
  Top Layer w0.508: U1.12 44.33,28.06 57.67,28.06 59.57,26.16 R7P.2
$1N112: length 47.5
  Top Layer w0.508: L7P.4 6.6,21.08 5.97,20.45 5.97,15.24 6.48,14.73 24.65,14.73 26.18,13.21 38.86,13.21 U1.7
$1N113: length 37.4
  Top Layer w0.508: L7P.3 14.94,18.54 18.75,22.35 25.15,22.35 26.16,23.37 38.86,23.37 U1.8
$1N114: length 36.3
  Top Layer w0.508: v1(39.24,20.83) 26.16,20.83 25.02,19.69 18.41,19.69 14.73,16 L7P.2
  Bottom Layer w0.508: U1.9 41.4,20.83 v1(39.24,20.83)
$1N115: length 27.3
  Top Layer w0.508: U1.24 35.05,29.72 41.4,23.37 43.69,23.37 44.45,22.61 44.45,19.05 44.96,18.54 R5P.4
$1N135: length 71.5
  Top Layer w0.508: ENCODER1.4 34.65,33.66 29.34,33.66 22.99,27.31 5.84,27.31 5.08,26.54 5.08,13.33 7.11,11.3 23.62,11.3 24.26,11.94 U1.17
$1N149: length 44.3
  Top Layer w0.508: U1.15 23.24,6.86 22.73,7.37 v1(22.73,9.02)
  Bottom Layer w0.508: v1(22.73,9.02) 16.76,9.02 12.45,13.33 12.45,29.59 15.8,32.95 v1(20.5,32.95)
$1N232: length 37.1
  Top Layer w0.508: v1(45.34,29.08) 49.27,29.08 51.69,31.5 55.5,31.5 57.02,33.02 H1.2
  Bottom Layer w0.508: v1(45.34,29.08) 45.34,27.54 43.7,25.91 33.78,25.91 U1.20
$1N233: length 33
  Top Layer w0.508: v1(45.21,31.88) 48.39,31.88 v1(48.64,32.13)
  Bottom Layer w0.508: H1.4 52.58,32.13 v1(48.64,32.13) ; v1(45.21,31.88) 45.21,30.1 43.56,28.45 33.78,28.45 27.43,22.1
$1N234: length 28.4
  Top Layer w0.508: v1(33.59,30.8) 33.78,30.99 48.9,30.99 51.94,34.04
  Bottom Layer w0.508: U1.22 v1(33.59,30.8)
$1N235: length 24.8
  Top Layer w0.508: v1(32.42,32.17) 33.02,32.77 48.13,32.77 H1.8
  Bottom Layer w0.508: U1.23 v1(32.42,32.17)
$1N236: length 53
  Bottom Layer w0.508: U1.1 45.34,4.45 45.34,6.74 46.48,7.87 57.91,7.87 62.48,12.45 62.48,13.46 55.75,20.19 55.75,35.31 H1.3
$1N237: length 45.9
  Top Layer w0.508: v1(46.61,30.1) 49.07,30.1 51.61,32.64 52.58,32.64 53.21,33.27 53.21,38.1 53.72,38.61 56.51,38.61 57.02,38.1 H1.1
  Bottom Layer w0.508: v1(46.61,30.1) 46.61,8.97 42.67,5.04 U1.2

## Copper pours and planes (outline as drawn; the poured copper is in the pictures)
GND on Top Layer: -6.1,51.31 -6.1,2.79 4.83,-8.13 81.15,-8.13 82.04,-7.24 82.04,48.13 78.99,51.18
GND on Bottom Layer: -5.97,53.21 84.2,53.21 84.2,-8.38 -5.97,-8.38

Small or netless copper shapes (teardrops, artwork), in the pictures only: 48 on Top Layer, 43 on Bottom Layer

## Text on the board
Bottom Silkscreen Layer: PGEKI_MINI / PCB V1.5
Top Silkscreen Layer: DO V G | 16  14  15  A0 | V  G  TX  RX | JLCJLCJLCJLC

# Board sidebar_PCB_0
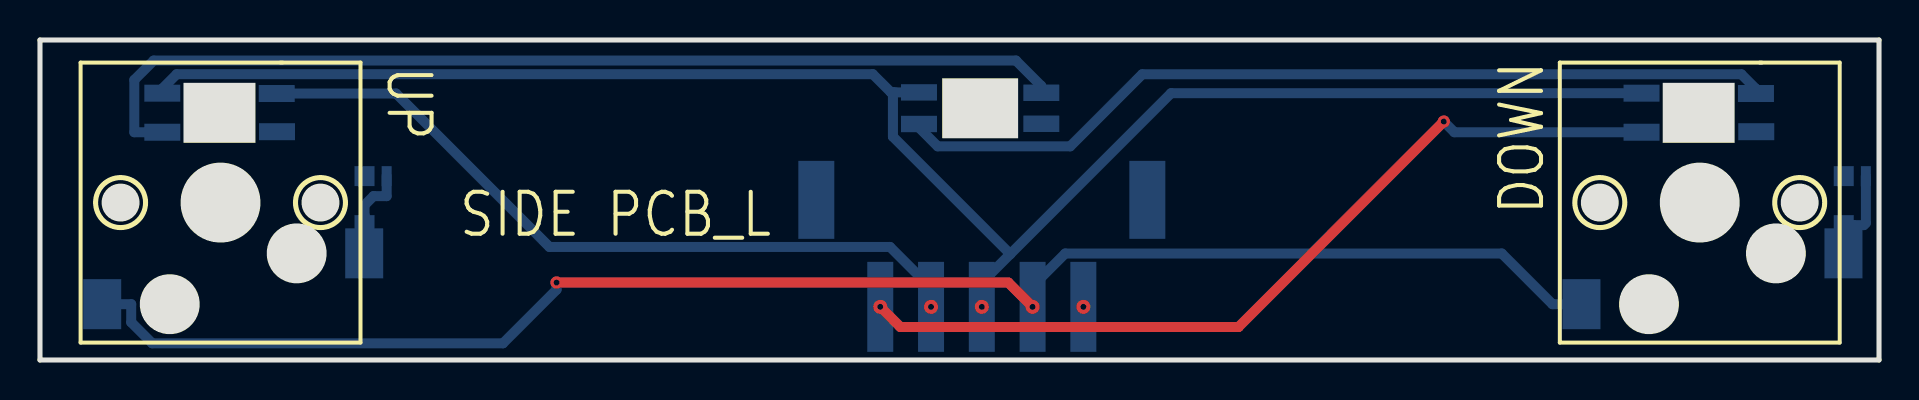
[diagram p7: board, top side]
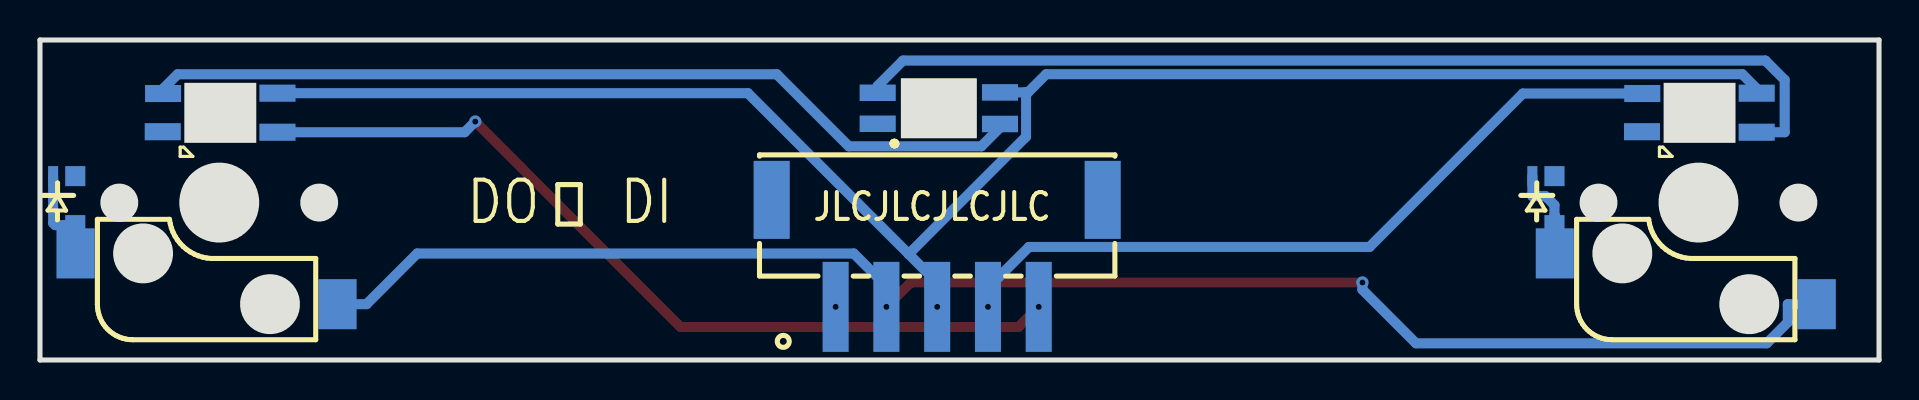
[diagram p8: board, bottom side, seen from below]

Outline 92 x 16 mm; copper layers: Top Layer, Bottom Layer. Coordinates in mm from the lower left corner of the outline.
Outline path: 0,16 92,16 92,0 0,0 0,16
Stack: Top Layer 0.035mm / Dielectric1 1.51mm FR4 er 4.5 / Bottom Layer 0.035mm

## Design rules (mm)
spacing Default (default): track to track 0.152, other pairs 0 to 0.152
track width Default (default): min 0.5, default 0.5, max 25.4
differential pair differentialPair (default): width min 0.127, default 0.254, max 2.54; gap min 0.152, default 0.152
via Default (default): diameter min 0.61, default 0.61, max 100.025; hole min 0.305, default 0.305, max 59.995

## Placement (name value [footprint] x y rotation side)
SW1  CHERRY-WS2812B-3528RGB 凯华热插拔 改  [凯华热插拔-WS2812-3528灯反贴-带二极管-KAILH-IN4148-3528]  9.03 7.87 0 top
SW2  CHERRY-WS2812B-3528RGB 凯华热插拔 改  [凯华热插拔-WS2812-3528灯反贴-带二极管-KAILH-IN4148-3528]  83.03 7.87 0 top
U2  XH2.54-5AB  [CONN-SMD_5P-P2.54_XH2.54-5AB]  47.12 5.33 180 bottom
U3  WS2812B-3528反贴 COPY  [WS2812-3528-反贴]  47.03 12.87 0 bottom

## Footprints (pads in the part's own frame, mm; a bottom-side part is the same pattern mirrored in y, then rotated)
CONN-SMD_5P-P2.54_XH2.54-5AB
  rect 1.3x4.5 smd: 1(-5.08,-2.675) 2(-2.539,-2.675) 3(0.001,-2.675) 4(2.541,-2.675) 5(5.08,-2.675)
  rect 1.8x3.9 smd: 6(-8.28,2.675) 7(8.28,2.675)
WS2812-3528-反贴
  rect 1.8x0.82 smd: DI(3.06,-0.49) DO(-3.06,1.07) G(3.06,1.06) V(-3.06,-0.51)
凯华热插拔-WS2812-3528灯反贴-带二极管-KAILH-IN4148-3528
  rect 0.5x1 smd far side: 1(8.31,1.323)
  rect 1.8x0.85 smd far side: DI(2.811,5.453) DO(-2.912,3.517) G(2.826,3.543) V(-2.913,5.469)
  rect 1.9x2.5 smd far side: KOL(7.188,-2.54) ROW(-5.918,-5.08)
  rect 1x1 smd far side: R1(7.203,1.323) R2(7.203,-1.128)

## Nets
SW1_DO: SW1.DO U3.DI
SW1_KOL: SW1.1 SW1.KOL SW1.R2
SW1_ROW: SW1.ROW SW2.ROW U2.2
SW2_DI: SW2.DI U3.DO
SW2_DO: SW2.DO U2.5
SW2_G: SW1.G SW1.R1 SW2.G SW2.R1 U2.1 U3.G
SW2_R2: SW2.1 SW2.KOL SW2.R2
SW2_V: SW1.V SW2.V U2.3 U3.V
U2_4: SW1.DI U2.4
U2_6: U2.6
U2_7: U2.7

## Via types
v1: diameter 0.7, hole 0.305, Top Layer to Bottom Layer, 5 vias
v2: diameter 0.61, hole 0.305, Top Layer to Bottom Layer, 2 vias

## Routing (per net, layer and track width the routed paths; a pad name or vN(x,y) marks a point on that pad's centre or on a via; arc(x,y) is an arc through that point)
SW1_DO: length 50.7
  Bottom Layer w0.5: 50.09,13.36 50.09,13.7 48.82,14.97 5.69,14.97 4.72,14 4.72,11.39 SW1.DO
SW1_KOL: length 5.2
  Bottom Layer w0.5: 16.23,7.24 16.22,7.23 SW1.KOL ; 16.23,7.24 SW1.R2 ; 16.23,7.24 16.23,7.74 16.68,8.19 17.34,8.19 SW1.1
SW1_ROW: length 80.1
  Top Layer w0.5: v1(49.66,2.66) 48.44,3.87 v2(25.84,3.87)
  Bottom Layer w0.5: v1(49.66,2.66) 49.66,3.69 51.29,5.32 73.13,5.32 75.66,2.79 SW2.ROW ; SW1.ROW 4.56,2.79 4.56,1.88 5.61,0.83 23.16,0.83 25.84,3.52 v2(25.84,3.87)
SW2_DI: length 44.5
  Bottom Layer w0.5: U3.DO 43.97,11.62 44.91,10.68 51.54,10.68 55.14,14.29 85.12,14.29 85.84,13.56 SW2.DI
SW2_DO: length 43
  Top Layer w0.5: 70.23,11.92 59.95,1.65 43.05,1.65 v1(42.04,2.66)
  Bottom Layer w0.5: v2(70.23,11.92) 70.76,11.39 SW2.DO
SW2_G:
  vias: v1(52.2,2.66)
SW2_R2: length 5.1
  Bottom Layer w0.5: SW2.1 91.34,6.85 91.24,6.74 90.74,6.74 ; SW2.KOL 90.22,6.23 90.74,6.74 ; 90.74,6.74 SW2.R2
SW2_V: length 87.4
  Bottom Layer w0.5: 48.54,5.3 42.67,11.17 42.67,13.38 ; 48.54,5.3 56.58,13.34 SW2.V ; 48.54,5.3 47.12,3.87 v1(47.12,2.66) ; 42.67,13.38 42.57,13.38 41.66,14.29 6.84,14.29 6.12,13.57 SW1.V ; 42.67,13.38 U3.V
U2_4: length 37.7
  Bottom Layer w0.5: SW1.DI 17.81,13.32 25.49,5.65 42.52,5.65 44.58,3.6 v1(44.58,2.66)

## Copper pours and planes (outline as drawn; the poured copper is in the pictures)
SW2_G on Bottom Layer: 0.19,-5.53 110.05,-5.53 110.43,-5.91 110.43,16.19 107.25,19.37 3.11,19.37 -0.95,23.43 -0.95,14.79 -1.21,14.54

## Text on the board
Bottom Silkscreen Layer: JLCJLCJLCJLC | DO   DI | ⬅
Top Silkscreen Layer: SIDE PCB_L | DOWN | UP

# Board button_PCB2
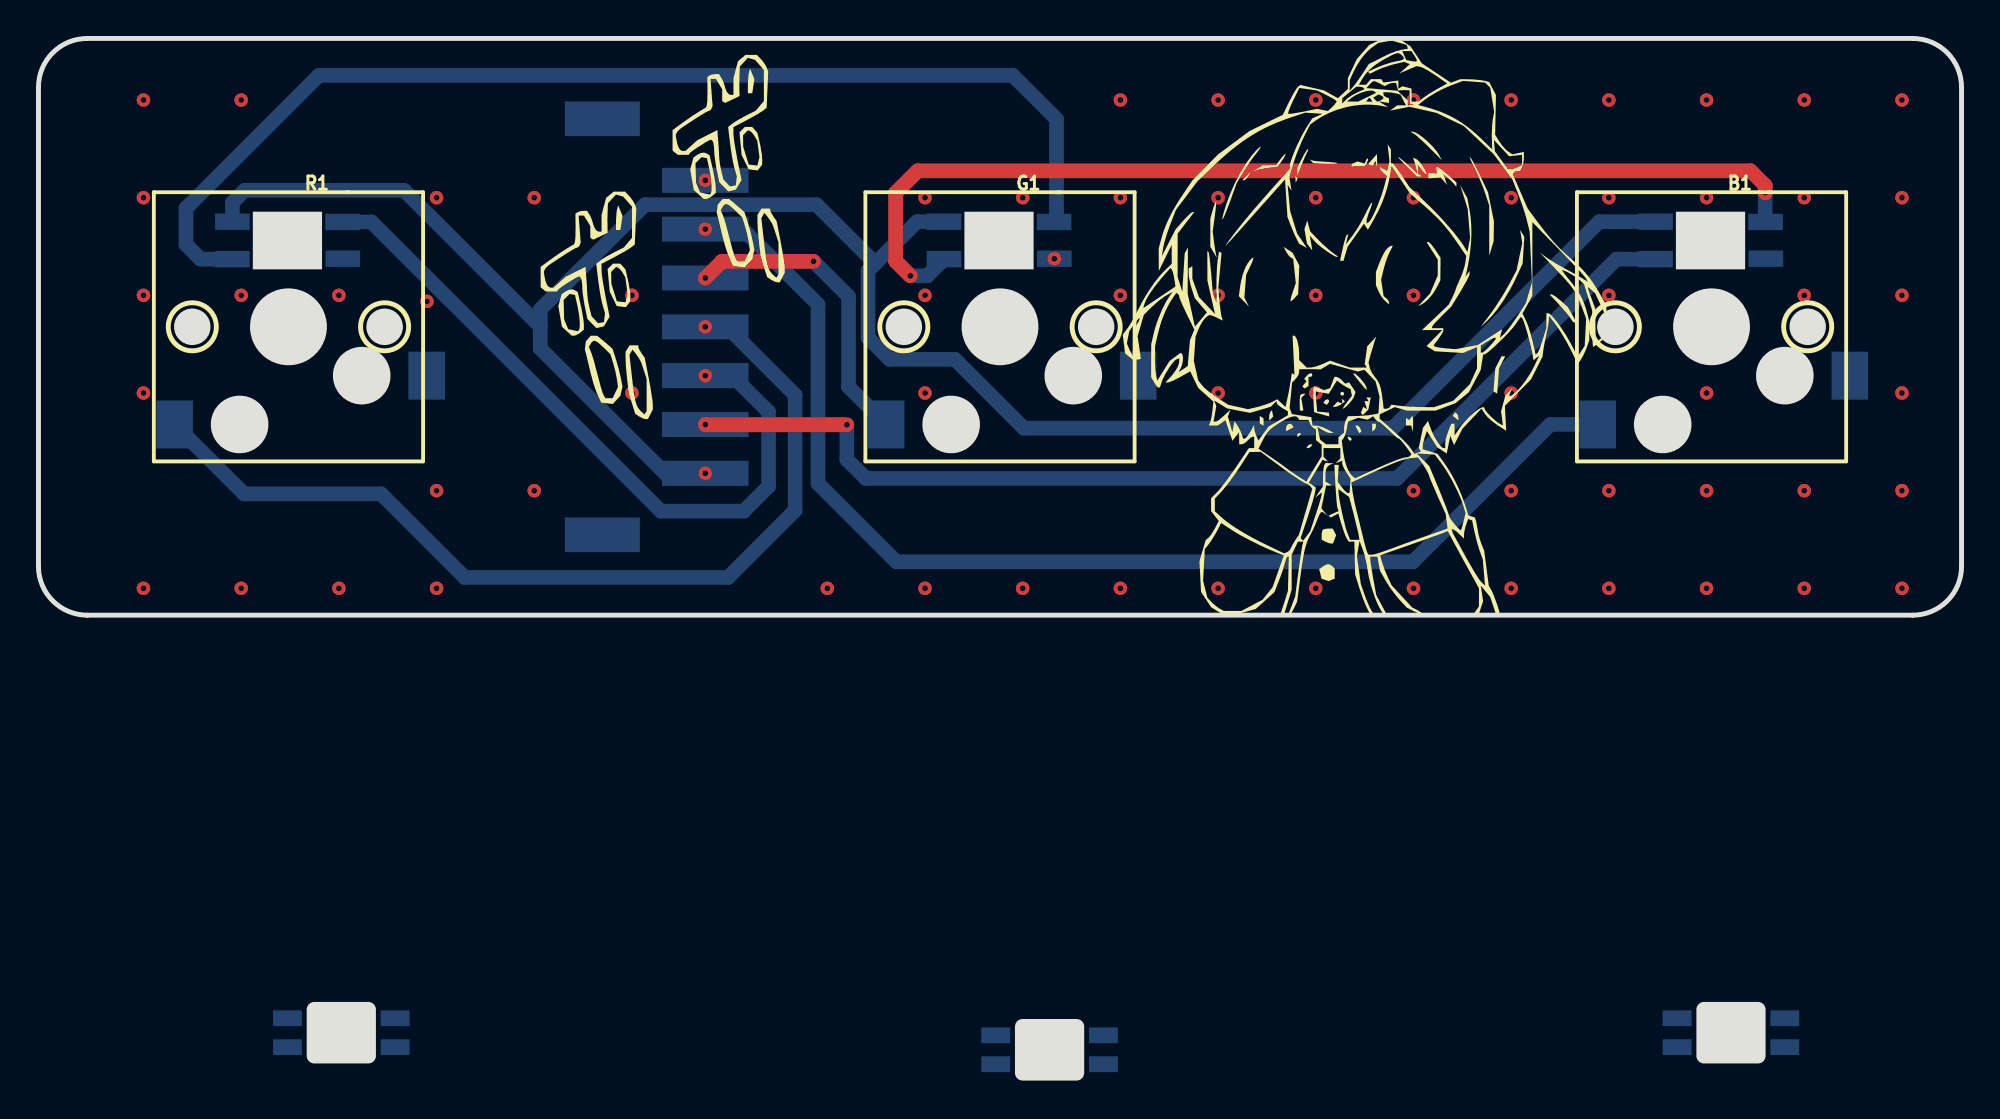
[diagram p9: board, top side]
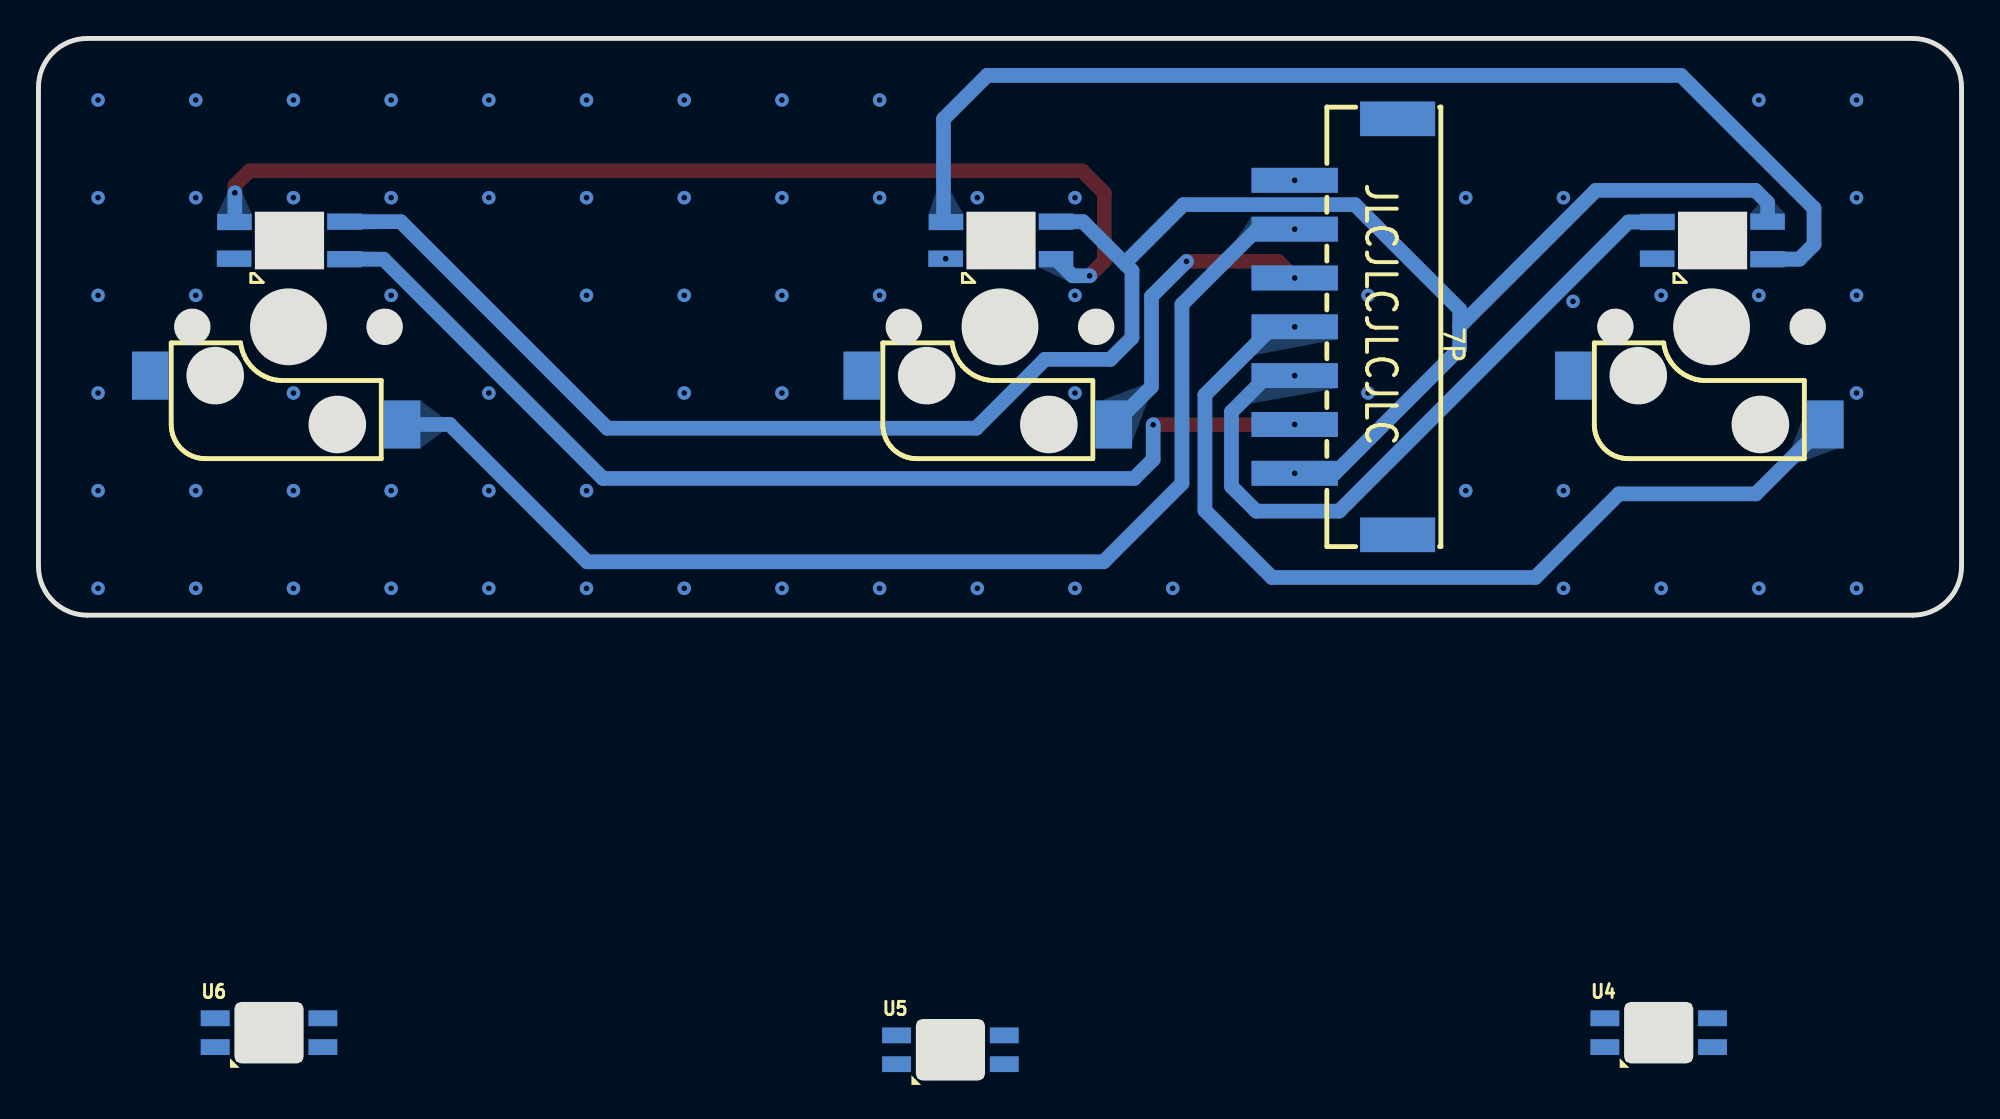
[diagram p10: board, bottom side, seen from below]

Outline 100 x 54.21 mm; copper layers: Top Layer, Bottom Layer. Coordinates in mm from the lower left corner of the outline.
Outline path: 0,51.67 arc(0.74,53.46) 2.54,54.21 97.46,54.21 arc(99.26,53.46) 100,51.67 100,26.75 arc(99.26,24.95) 97.46,24.21 2.54,24.21 arc(0.74,24.95) 0,26.75 0,51.67
Stack: Top Layer 0.035mm / Dielectric1 1.51mm FR4 er 4.5 / Bottom Layer 0.035mm

## Design rules (mm)
spacing Default (default): track to track 0.152, other pairs 0 to 0.152
track width Default (default): min 0.5, default 0.5, max 25.4
differential pair differentialPair (default): width min 0.127, default 0.254, max 2.54; gap min 0.152, default 0.152
via Default (default): diameter min 0.7, default 0.7, max 100.025; hole min 0.305, default 0.305, max 59.995
pour e93 uses gge35328

## Placement (name value [footprint] x y rotation side)
7P  XH2.54-7AB  [CONN-SMD_7P-P2.54_XH2.54-7AB]  32 39.21 270 bottom
B1  CHERRY-WS2812B-3528RGB 凯华热插拔 改  [凯华热插拔-WS2812-3528灯反贴-带二极管-KAILH-IN4148-3528]  87 39.21 0 top
G1  CHERRY-WS2812B-3528RGB 凯华热插拔 改  [凯华热插拔-WS2812-3528灯反贴-带二极管-KAILH-IN4148-3528]  50 39.21 0 top
R1  CHERRY-WS2812B-3528RGB 凯华热插拔 改  [凯华热插拔-WS2812-3528灯反贴-带二极管-KAILH-IN4148-3528]  13 39.21 0 top
U4  Yo-WS2812B-3528反贴雾状  [LED-SMD_L3.2-W2.8-BR_DY-S352818]  15.75 2.49 180 bottom
U5  Yo-WS2812B-3528反贴雾状  [LED-SMD_L3.2-W2.8-BR_DY-S352818]  52.58 1.6 180 bottom
U6  Yo-WS2812B-3528反贴雾状  [LED-SMD_L3.2-W2.8-BR_DY-S352818]  88.01 2.49 180 bottom

## Footprints (pads in the part's own frame, mm; a bottom-side part is the same pattern mirrored in y, then rotated)
CONN-SMD_7P-P2.54_XH2.54-7AB
  rect 1.3x4.5 smd: 1(-7.62,-2.675) 2(-5.08,-2.675) 3(-2.54,-2.675) 4(0,-2.675) 5(2.54,-2.675) 6(5.08,-2.675) 7(7.62,-2.675)
  rect 1.8x3.9 smd: 8(-10.82,2.675) 9(10.82,2.675)
LED-SMD_L3.2-W2.8-BR_DY-S352818
  rect 1.5x0.82 smd: 1(2.8,-0.75) 2(2.8,0.75) 3(-2.8,0.75) 4(-2.8,-0.75)
凯华热插拔-WS2812-3528灯反贴-带二极管-KAILH-IN4148-3528
  rect 1.8x0.85 smd far side: DI(2.811,5.453) DO(-2.912,3.517) G(2.826,3.543) V(-2.913,5.469)
  rect 1.9x2.5 smd far side: KOL(7.188,-2.54) ROW(-5.918,-5.08)

## Nets
$3N13: 7P.1 B1.G B1.KOL G1.G G1.KOL R1.G R1.KOL
$3N16: G1.DI R1.DO
$3N17: B1.DI G1.DO
$3N18: 7P.2 B1.ROW
$3N19: 7P.3 G1.ROW
$3N20: 7P.4 R1.ROW
$3N21: 7P.5 R1.DI
$3N22: 7P.6 B1.DO
$3N23: 7P.7 B1.V G1.V R1.V

Pads without a net: 7P 8 9; U4 1 2 3 4; U5 1 2 3 4; U6 1 2 3 4

## Via types
v1: diameter 0.7, hole 0.305, Top Layer to Bottom Layer, 13 vias
v2: diameter 0.701, hole 0.305, Top Layer to Bottom Layer, 69 vias

## Routing (per net, layer and track width the routed paths; a pad name or vN(x,y) marks a point on that pad's centre or on a via; arc(x,y) is an arc through that point)
(no net):
  vias: v1(20.2,40.53)
$3N13:
  vias: v1(34.68,46.83) v1(52.83,42.75) v2(5.46,51) v2(5.46,45.92) v2(5.46,40.84) v2(5.46,35.76) v2(5.46,25.6) v2(10.54,51) v2(10.54,40.84) v2(10.54,25.6) v2(15.62,40.84) v2(15.62,25.6) v2(20.7,45.92) v2(20.7,30.68) v2(20.7,25.6) v2(25.78,45.92) v2(25.78,30.68) v2(30.86,40.84) v2(30.86,35.76) v2(41.02,25.6) v2(46.1,45.92) v2(46.1,40.84) v2(46.1,35.76) v2(46.1,25.6) v2(51.18,45.92) v2(51.18,25.6) v2(56.26,51) v2(56.26,45.92) v2(56.26,40.84) v2(56.26,25.6) v2(61.34,51) v2(61.34,45.92) v2(61.34,40.84) v2(61.34,35.76) v2(61.34,25.6) v2(66.42,51) v2(66.42,45.92) v2(66.42,40.84) v2(66.42,35.76) v2(66.42,25.6) v2(71.5,51) v2(71.5,45.92) v2(71.5,40.84) v2(71.5,30.68) v2(71.5,25.6) v2(76.58,51) v2(76.58,45.92) v2(76.58,35.76) v2(76.58,30.68) v2(76.58,25.6) v2(81.66,51) v2(81.66,45.92) v2(81.66,40.84) v2(81.66,30.68) v2(81.66,25.6) v2(86.74,51) v2(86.74,45.92) v2(86.74,35.76) v2(86.74,30.68) v2(86.74,25.6) v2(91.82,51) v2(91.82,45.92) v2(91.82,40.84) v2(91.82,30.68) v2(91.82,25.6) v2(96.9,51) v2(96.9,45.92) v2(96.9,40.84) v2(96.9,35.76) v2(96.9,30.68) v2(96.9,25.6)
$3N16: length 59.1
  Bottom Layer w0.762: 52.81,44.66 52.94,44.79 52.94,50.01 50.67,52.29 14.58,52.29 7.67,45.37 7.67,43.49 8.43,42.72 R1.DO
$3N17: length 54.6
  Top Layer w0.762: v1(45.34,41.86) 44.58,42.62 44.58,46.18 45.72,47.32 89.03,47.32 89.79,46.56 v1(89.79,46.18)
  Bottom Layer w0.762: v1(89.79,46.18) 89.79,44.68 B1.DI ; v1(45.34,41.86) 46.22,41.86 G1.DO
$3N18: length 62
  Bottom Layer w0.762: v1(34.68,44.29) 36.62,44.29 40.54,40.37 40.54,31.06 44.61,26.98 71.47,26.98 78.62,34.13 81.08,34.13
$3N19: length 16
  Top Layer w0.762: v1(40.3,42.61) 35.54,42.61 v1(34.68,41.75)
  Bottom Layer w0.762: v1(40.3,42.61) 42.12,40.79 42.12,36.09 44.08,34.13
$3N20: length 49.1
  Bottom Layer w0.762: v1(34.68,39.21) 35.8,39.21 39.34,35.66 39.34,29.66 35.86,26.17 22.16,26.17 17.82,30.52 10.69,30.52 7.08,34.13
$3N21: length 36.9
  Bottom Layer w0.762: R1.DI 17.32,44.66 32.36,29.62 36.68,29.62 37.96,30.91 37.96,34.78 36.08,36.67 v1(34.68,36.67)
$3N22: length 56.4
  Top Layer w0.762: v1(34.68,34.13) 34.69,34.11 v1(42.04,34.11)
  Bottom Layer w0.762: v1(42.04,34.11) 42.04,32.31 43.02,31.32 70.65,31.32 82.05,42.72 B1.DO
$3N23: length 110.3
  Bottom Layer w0.762: 26.1,39.22 19.01,46.31 10.72,46.31 10.09,45.67 R1.V ; 26.1,39.22 26.1,40.11 31.55,45.56 40.46,45.56 43.52,42.51 ; 26.1,39.22 26.1,38.08 32.59,31.59 v1(34.68,31.59) ; 43.52,42.51 43.14,42.13 43.14,38.64 44.26,37.52 47.66,37.52 51.24,33.93 70.42,33.93 81.16,44.68 B1.V ; 43.52,42.51 45.69,44.68 G1.V

## Copper pours and planes (outline as drawn; the poured copper is in the pictures)
$3N13 on Top Layer: -9.78,68.28 -9.78,10.49 -9.65,10.36 105.92,10.36 107.31,11.76 107.31,63.83 103.63,67.51 104.78,67.51
$3N13 on Bottom Layer: -6.86,61.93 -6.86,14.17 -7.11,13.92 109.35,13.92 111.25,15.82 111.25,56.72 108.84,59.13

Small or netless copper shapes (teardrops, artwork), in the pictures only: 15 on Bottom Layer

## Text on the board
Bottom Silkscreen Layer: JLCJLCJLCJLC

# Board sidebar_PCB_1
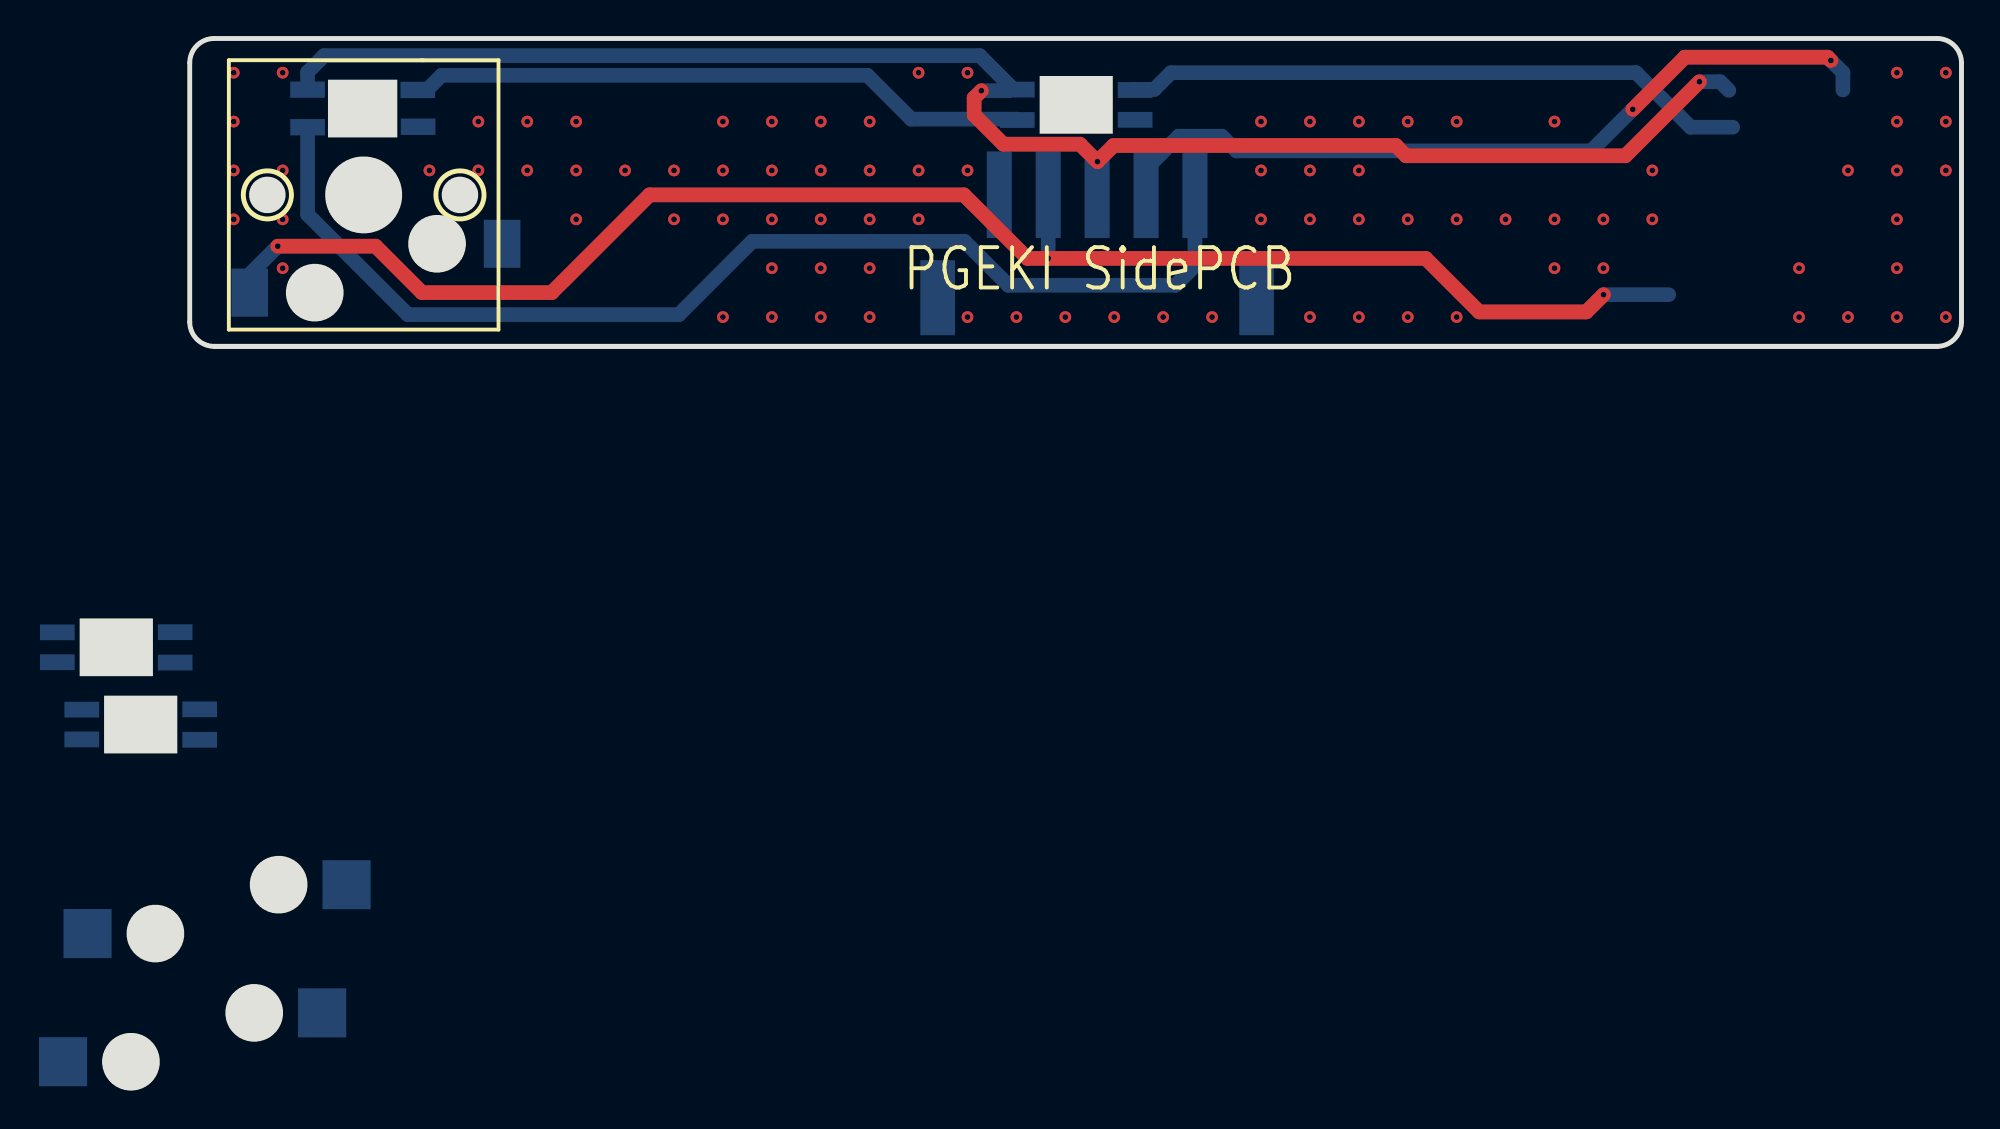
[diagram p11: board, top side]
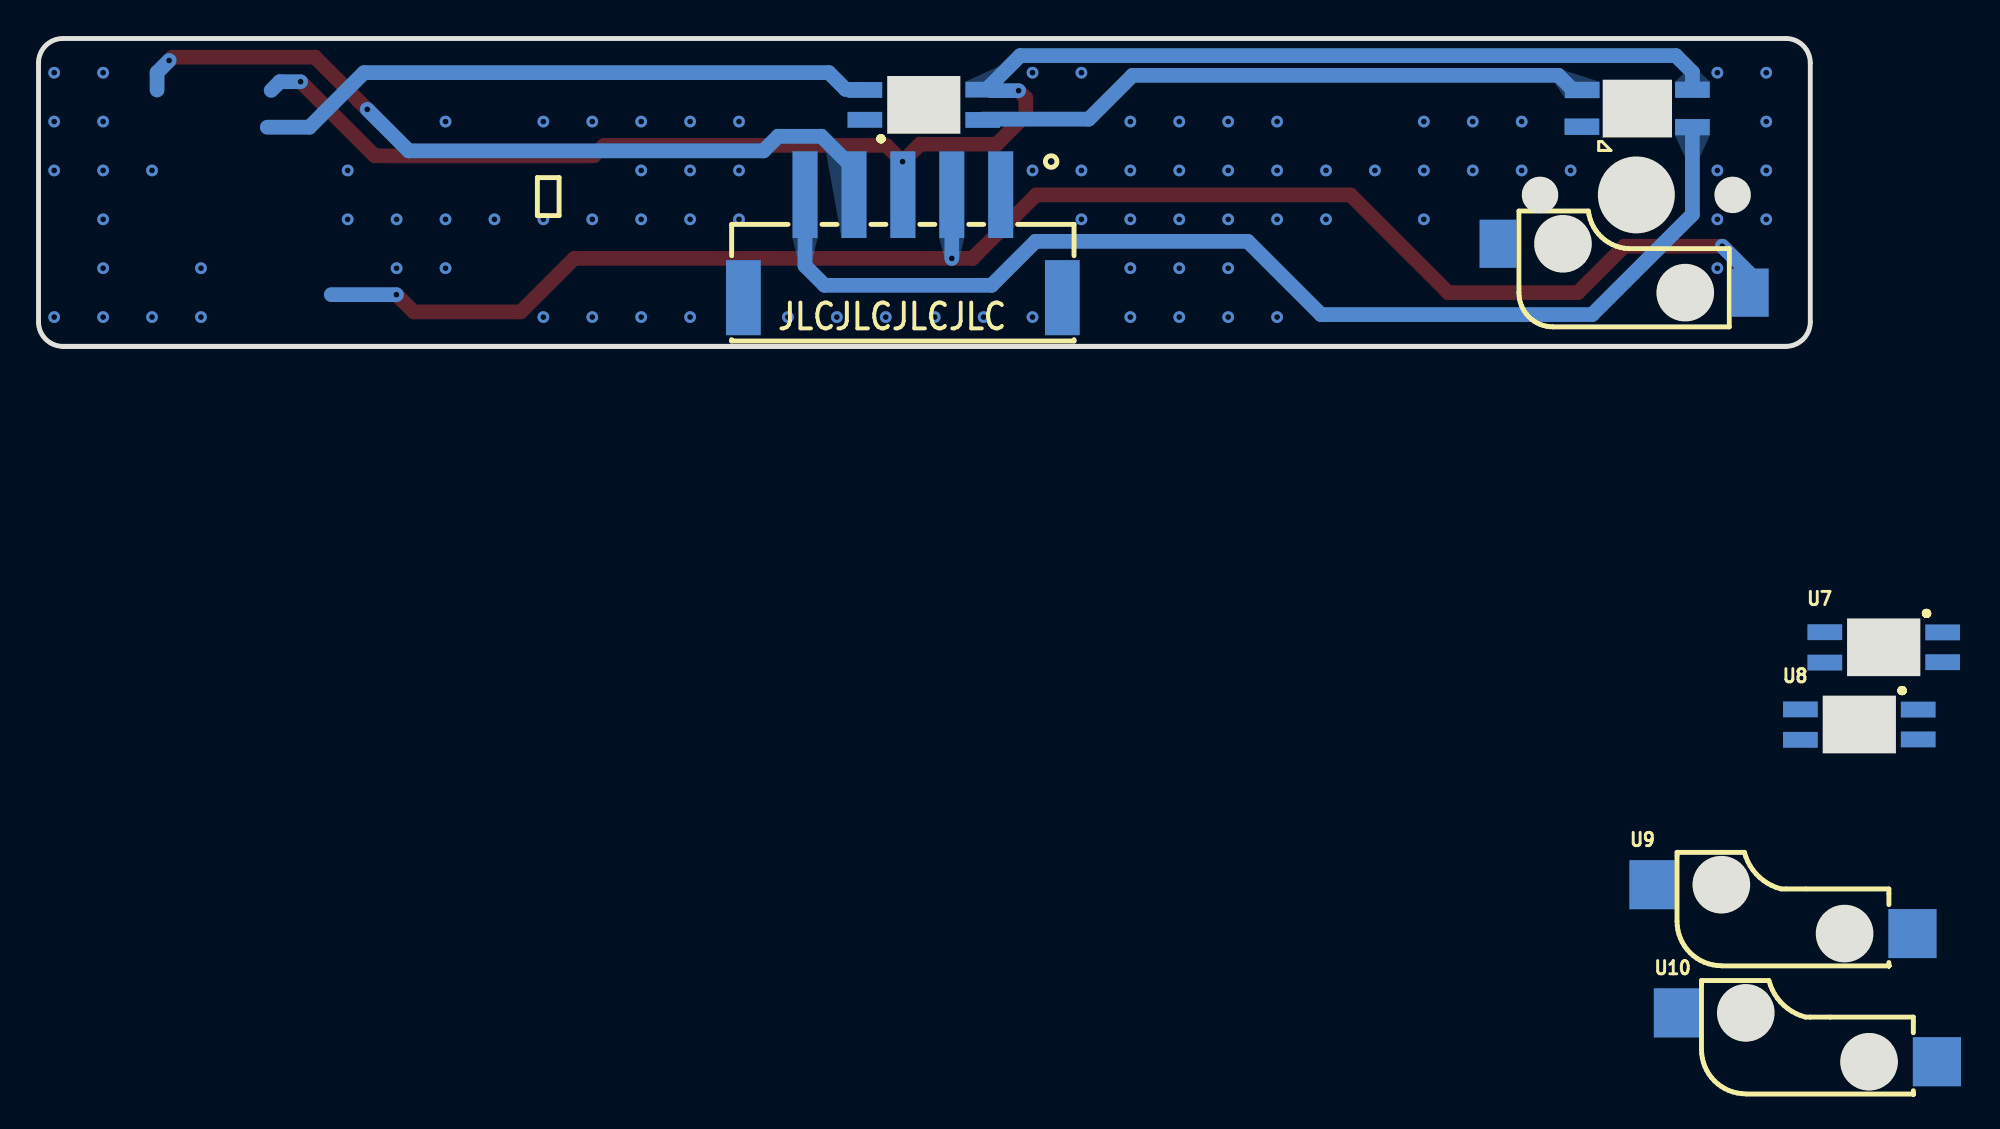
[diagram p12: board, bottom side, seen from below]

Outline 97.71 x 54.67 mm; copper layers: Top Layer, Bottom Layer. Coordinates in mm from the lower left corner of the outline.
Outline path: 6.98,38.67 arc(6.09,39.05) 5.72,39.94 5.72,53.4 arc(6.09,54.3) 6.98,54.67 96.45,54.67 arc(97.34,54.3) 97.71,53.4 97.71,39.94 arc(97.34,39.05) 96.45,38.67 ; 6.98,38.67 96.45,38.67 ; 6.98,38.67 96.45,38.67
Stack: Top Layer 0.035mm / Dielectric1 1.51mm FR4 er 4.5 / Bottom Layer 0.035mm

## Design rules (mm)
spacing Default (default): track to track 0.152, other pairs 0 to 0.152
track width Default (default): min 0.5, default 0.5, max 25.4
differential pair differentialPair (default): width min 0.127, default 0.254, max 2.54; gap min 0.152, default 0.152
via Default (default): diameter min 0.61, default 0.61, max 100.025; hole min 0.305, default 0.305, max 59.995

## Placement (name value [footprint] x y rotation side)
SW1  CHERRY-WS2812B-3528RGB 凯华热插拔 改  [凯华热插拔-WS2812-3528灯反贴-带二极管-KAILH-IN4148-3528]  14.75 46.54 0 top
U2  XH2.54-5AB  [CONN-SMD_5P-P2.54_XH2.54-5AB]  52.83 43.88 0 bottom
U3  WS2812B-3528反贴 COPY  [WS2812-3528-反贴]  51.75 51.51 0 bottom
U7  WS2812B-3528反贴 COPY  [WS2812-3528-反贴]  1.9 22.75 180 bottom
U8  WS2812B-3528反贴 COPY  [WS2812-3528-反贴]  3.17 18.74 180 bottom
U9  CPG151101S11-16  [SMD_KEYBOARD-SW]  7.13 9.43 180 bottom
U10  CPG151101S11-16  [SMD_KEYBOARD-SW]  5.86 2.77 180 bottom

## Footprints (pads in the part's own frame, mm; a bottom-side part is the same pattern mirrored in y, then rotated)
CONN-SMD_5P-P2.54_XH2.54-5AB
  rect 1.3x4.5 smd: 1(-5.08,-2.675) 2(-2.539,-2.675) 3(0.001,-2.675) 4(2.541,-2.675) 5(5.08,-2.675)
  rect 1.8x3.9 smd: 6(-8.28,2.675) 7(8.28,2.675)
SMD_KEYBOARD-SW
  rect 2.5x2.55 smd: 1(-6.725,1.27) 2(6.725,-1.27)
WS2812-3528-反贴
  rect 1.8x0.82 smd: DI(3.06,-0.49) DO(-3.06,1.07) G(3.06,1.06) V(-3.06,-0.51)
凯华热插拔-WS2812-3528灯反贴-带二极管-KAILH-IN4148-3528
  rect 1.8x0.85 smd far side: DI(2.811,5.453) DO(-2.912,3.517) G(2.826,3.543) V(-2.913,5.469)
  rect 1.9x2.5 smd far side: KOL(7.188,-2.54) ROW(-5.918,-5.08)

## Nets
$2N13: SW1.V U2.3 U3.V
$2N14: U2.4
$2N15: SW1.G SW1.KOL U2.1 U3.G
$2N17: SW1.ROW U2.2
$2N28: U3.DI
$2N29: SW1.DI U3.DO
$2N30: SW1.DO U2.5

Pads without a net: U2 6 7; U7 DI DO G V; U8 DI DO G V; U9 1 2; U10 1 2

## Via types
v1: diameter 0.61, hole 0.305, Top Layer to Bottom Layer, 96 vias

## Routing (per net, layer and track width the routed paths; a pad name or vN(x,y) marks a point on that pad's centre or on a via; arc(x,y) is an arc through that point)
$2N13: length 84.1
  Top Layer w0.762: v1(84.11,52.43) 80.26,48.58 68.88,48.58 68.34,49.11 53.69,49.11 v1(52.85,48.27) 51.94,49.18 47.96,49.18 46.45,50.7 46.45,51.58 v1(46.82,51.96)
  Bottom Layer w0.762: v1(46.82,51.96) 48.23,51.96 48.4,52.13 46.74,53.78 12.7,53.78 11.83,52.92 SW1.V ; v1(84.11,52.43) 85.18,52.43 85.63,51.98
$2N14: length 42.1
  Top Layer w0.762: v1(90.93,53.53) 90.76,53.7 83.36,53.7 v1(80.64,50.99)
  Bottom Layer w0.762: v1(90.93,53.53) 91.56,52.9 91.56,52 ; v1(80.64,50.99) 78.49,48.83 60.07,48.83 59.31,49.59 57.07,49.59 55.37,47.9 55.37,46.3
$2N15:
  vias: v1(8,52.9) v1(8,50.36) v1(8,47.82) v1(8,45.28) v1(10.54,52.9) v1(10.54,47.82) v1(10.54,45.28) v1(10.54,42.74) v1(18.16,47.82) v1(20.7,50.36) v1(20.7,47.82) v1(23.24,50.36) v1(23.24,47.82) v1(25.78,50.36) v1(25.78,47.82) v1(25.78,45.28) v1(28.32,47.82) v1(30.86,47.82) v1(30.86,45.28) v1(33.4,50.36) v1(33.4,47.82) v1(33.4,45.28) v1(33.4,40.2) v1(35.94,50.36) v1(35.94,47.82) v1(35.94,45.28) v1(35.94,42.74) v1(35.94,40.2) v1(38.48,50.36) v1(38.48,47.82) v1(38.48,45.28) v1(38.48,42.74) v1(38.48,40.2) v1(41.02,50.36) v1(41.02,47.82) v1(41.02,45.28) v1(41.02,42.74) v1(41.02,40.2) v1(43.56,52.9) v1(43.56,47.82) v1(43.56,45.28) v1(46.1,52.9) v1(46.1,47.82) v1(46.1,40.2) v1(48.64,40.2) v1(51.18,40.2) v1(53.72,40.2) v1(56.26,40.2) v1(58.8,40.2) v1(61.34,50.36) v1(61.34,47.82) v1(61.34,45.28) v1(63.88,50.36) v1(63.88,47.82) v1(63.88,45.28) v1(63.88,40.2) v1(66.42,50.36) v1(66.42,47.82) v1(66.42,45.28) v1(66.42,40.2) v1(68.96,50.36) v1(68.96,45.28) v1(68.96,40.2) v1(71.5,50.36) v1(71.5,45.28) v1(71.5,40.2) v1(74.04,45.28) v1(76.58,50.36) v1(76.58,45.28) v1(76.58,42.74) v1(79.12,45.28) v1(79.12,42.74) v1(81.66,47.82) v1(81.66,45.28) v1(89.28,42.74) v1(89.28,40.2) v1(91.82,47.82) v1(91.82,40.2) v1(94.36,52.9) v1(94.36,50.36) v1(94.36,47.82) v1(94.36,45.28) v1(94.36,42.74) v1(94.36,40.2) v1(96.9,52.9) v1(96.9,50.36) v1(96.9,47.82) v1(96.9,40.2)
$2N17: length 84.3
  Top Layer w0.762: v1(10.29,43.88) 15.37,43.88 17.78,41.47 24.51,41.47 29.59,46.55 45.91,46.55 49.21,43.24 v1(50.29,43.24) 69.89,43.24 72.67,40.46 78.23,40.46 v1(79.13,41.36)
  Bottom Layer w0.762: v1(79.13,41.36) 82.51,41.36 ; v1(50.29,43.24) 50.29,46.3 ; v1(10.29,43.88) 8.83,42.42 SW1.ROW
$2N28: length 32.6
  Bottom Layer w0.762: 54.79,52.03 55.8,52.03 56.67,52.9 80.82,52.9 83.65,50.06 85.83,50.06
$2N29: length 32.4
  Bottom Layer w0.762: 48.7,50.48 43.18,50.48 40.9,52.76 18.8,52.76 18.03,52 SW1.DI
$2N30: length 59.1
  Bottom Layer w0.762: SW1.DO 11.83,45.53 17.04,40.32 31.11,40.32 34.92,44.13 45.94,44.13 48.23,41.85 56.9,41.85 57.91,42.86 57.91,46.3

## Copper pours and planes (outline as drawn; the poured copper is in the pictures)
$2N15 on Top Layer: -2.16,66.74 107.57,66.74 107.57,30.04 -2.16,30.04
$2N15 on Bottom Layer: 4.7,57.72 98.68,57.72 98.68,34.48 4.7,34.48

Small or netless copper shapes (teardrops, artwork), in the pictures only: 7 on Bottom Layer

## Text on the board
Bottom Silkscreen Layer: JLCJLCJLCJLC | ⬅
Top Silkscreen Layer: PGEKI SidePCB
